# EAGLE board BatteryBoardV2 (EAGLE 8.3.1)
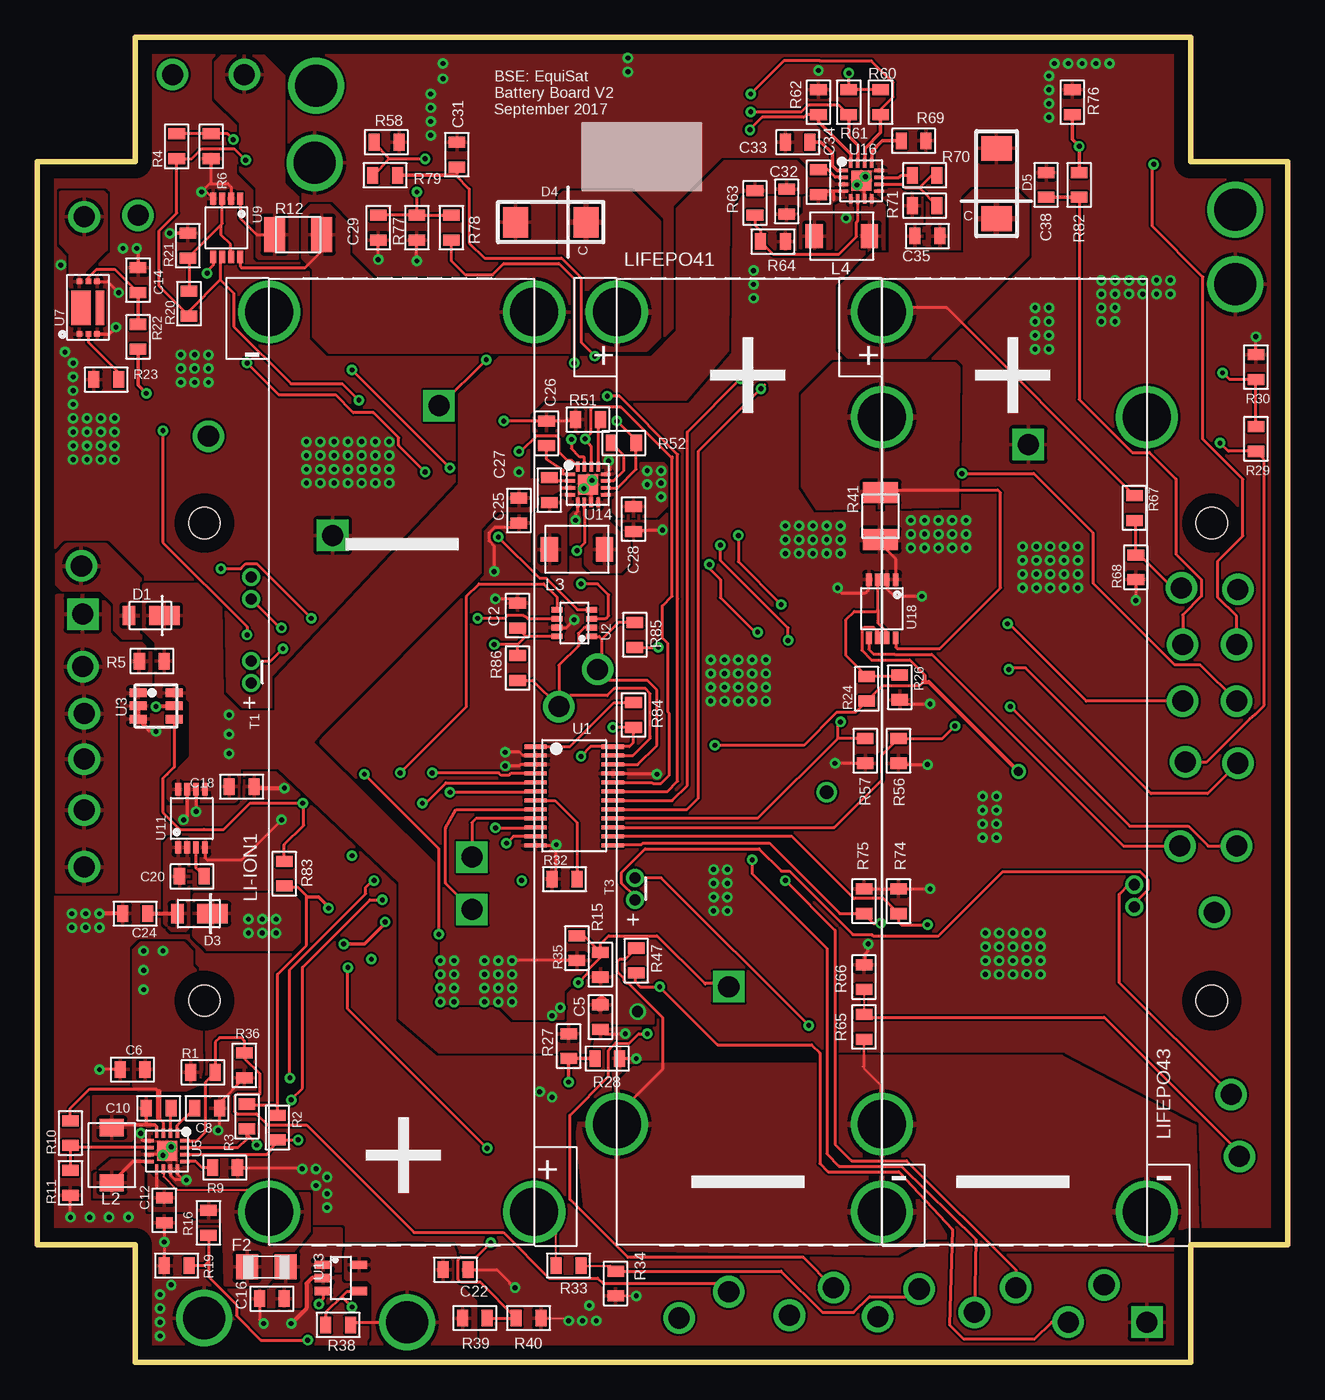
[diagram p6: board, top side]
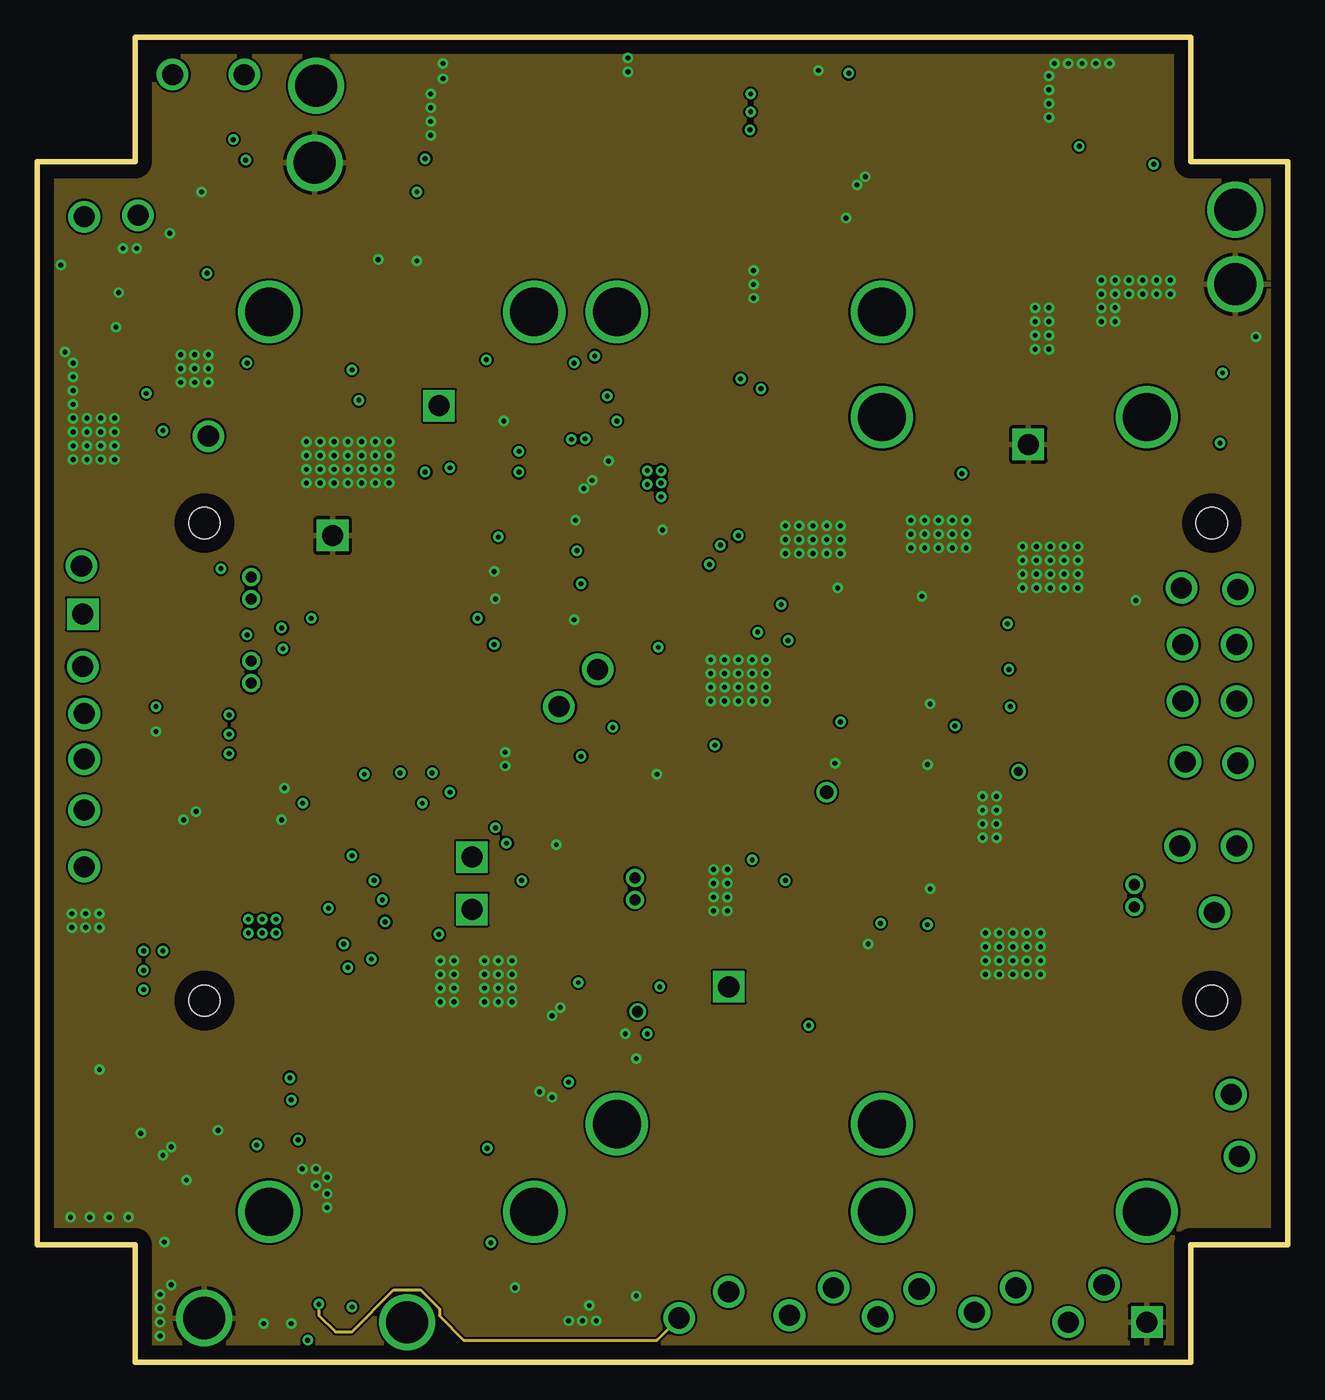
[diagram p7: board, inner layer Route2]
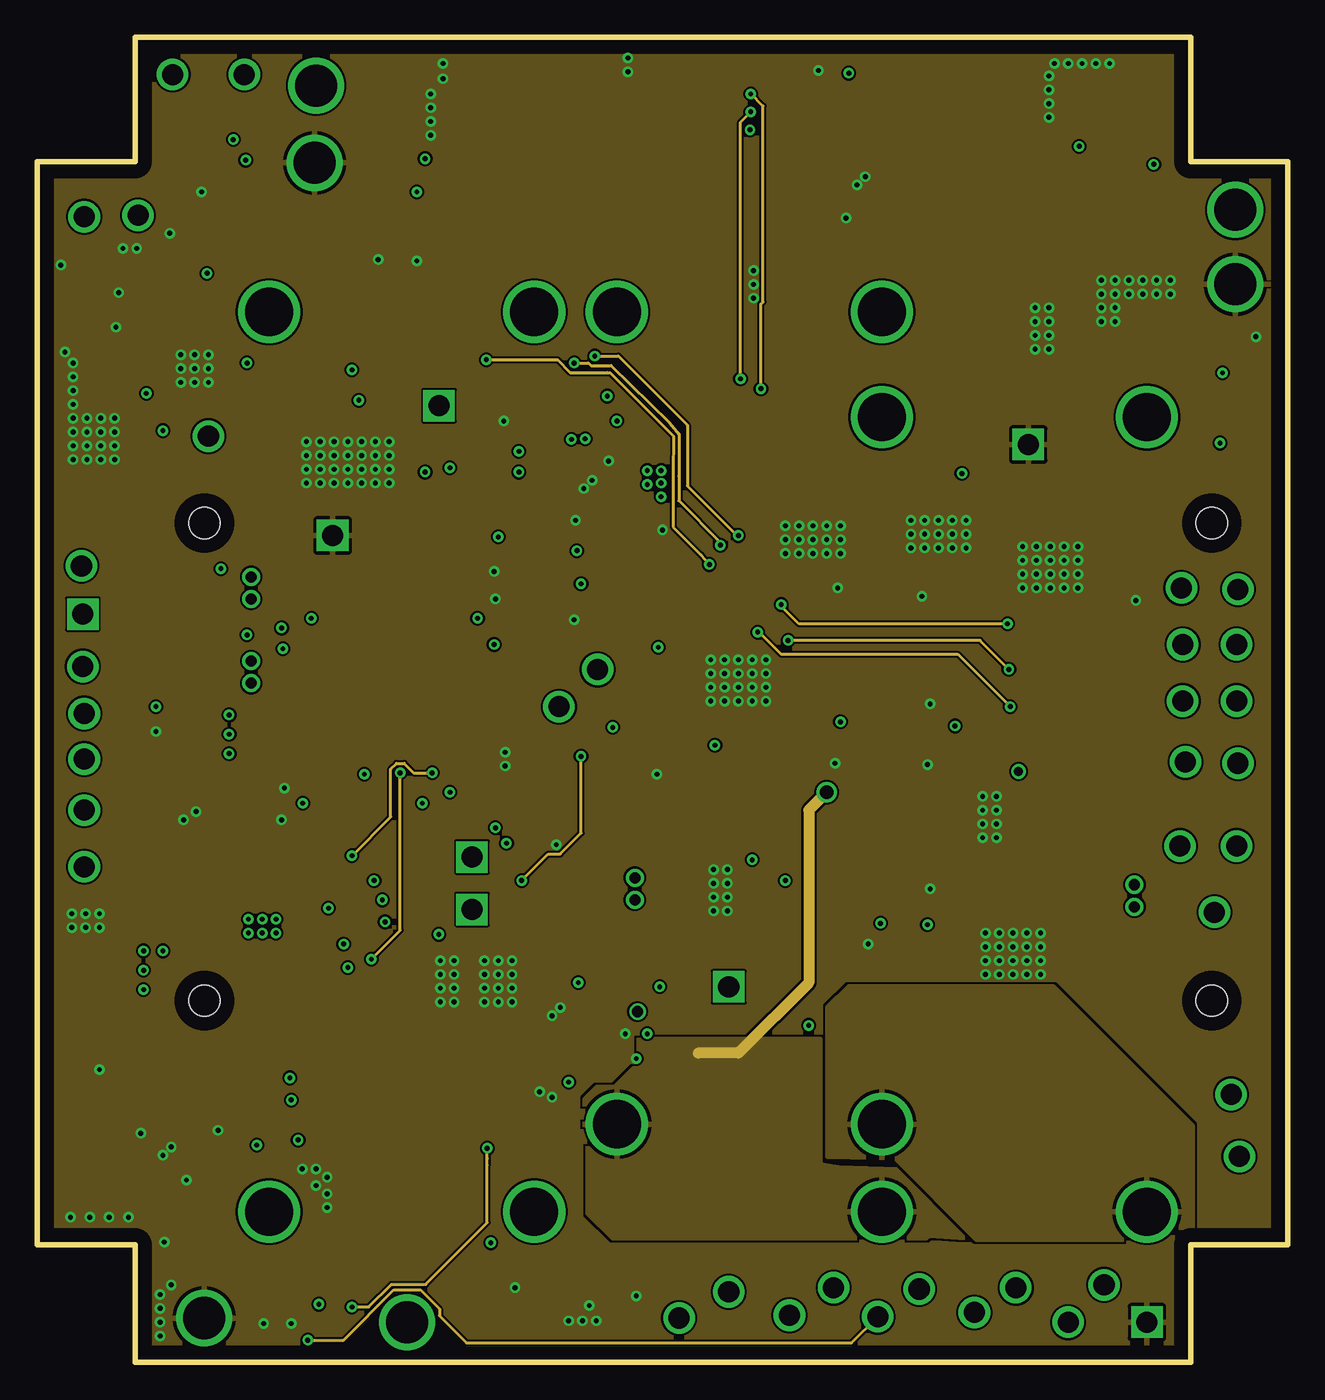
[diagram p8: board, inner layer Route3]
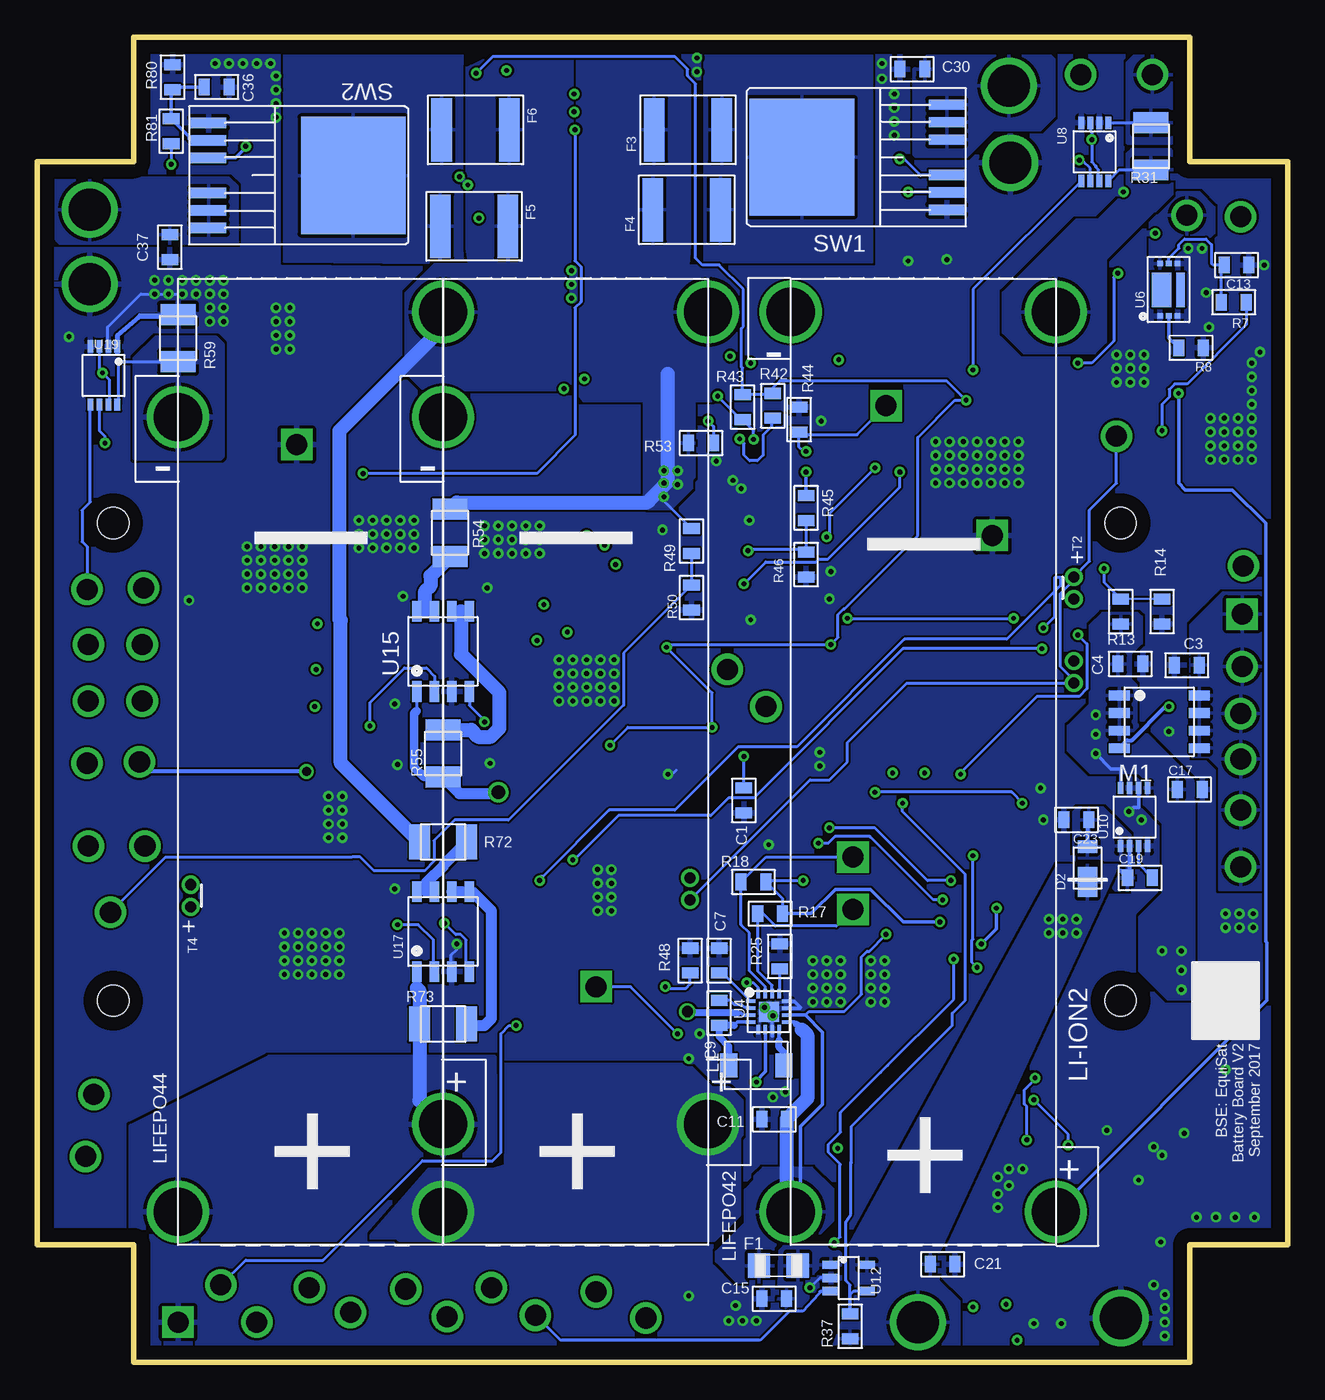
[diagram p9: board, bottom side, seen from below]

Size 90.6 x 96 mm. Coordinates in mm from the lower left corner, seen from the top.
Outline: 0,87 7.1,87 7.1,96 83.6,96 83.6,87 90.6,87 90.6,8.5 83.6,8.5 83.6,0 7.1,0 7.1,8.5 0,8.5 0,87
Copper layers (1*2*3*16): Top 0.035mm / dielectric 0.25mm / Route2 0.035mm / dielectric 0.25mm / Route3 0.035mm / dielectric 0.25mm / Bottom 0.035mm
Design rules "default *": minimum track width 8mil, minimum drill 13mil, track to track 6mil, track to pad 6mil, pad to pad 6mil, via to via 6mil, smd to smd 6mil, copper to edge 40mil, drill to drill 8mil, minimum pad ring 10mil, minimum via ring 8mil, stop-mask expansion 4mil, vias tented up to drill 0mil, thermal gap 10mil
Net classes: 0 default: width 0.254 mm, drill 0.584 mm; 1 Digital: width 0.203 mm, drill 0.381 mm; 2 Analog: width 0.203 mm, drill 0.381 mm; 3 Li-ion: width 2.032 mm, drill 1.905 mm; 4 I2C: width 0.254 mm, drill 0.584 mm, clearance 0.508 mm; 5 SolarPower: width 1.016 mm, drill 1.27 mm; 6 3V3: width 0.381 mm, drill 0.584 mm

## Footprints (pad centres in the part's own frame; a part is rotated, then mirrored left to right if it is on the bottom)
0805 = smd 0.8 x 1.2: 1 -0.9,0; 2 0.9,0
PWRDI-123 = smd 0.9 x 1.4: A 1.45,0 | smd 2.2 x 1.4: C -1.1,0
DO214AA = smd 1.8 x 2.2: A 2.55,0; C -2.55,0
1206 = smd 1.6 x 1.8: 1 -1.4,0; 2 1.4,0
2016 = smd 1.5 x 4.6: P$1 0,0; P$2 4.9,0
1812 = smd 1.25 x 1.75: P$1 -2,0; P$2 2,0
EQUISAT-BATTERY-VA = drill 3.5: MINUS 9.6,-32.6; PLUS -9.6,32.6
EQUISAT-BATTERY-VB = drill 3.5: MINUS 9.6,-24.98; PLUS -9.6,26.25
SO-8 = smd 0.7 x 1.5: P$1 -1.905,-2.9; P$2 -0.635,-2.9; P$3 0.635,-2.9; P$4 1.905,-2.9; P$5 1.905,2.9; P$6 0.635,2.9; P$7 -0.635,2.9; P$8 -1.905,2.9
#2-CLOSE-NPTH = hole 2.27: 0,0
1210 = smd 1.52 x 2.54: P$1 -1.71,0 | smd 1.51 x 2.54: P$2 1.71,0
TO-263-7-8 = smd 0.75 x 2.6: P$1 0,0.7; P$2 1.27,0.7; P$3 2.54,0.7; P$5 5.08,0.7; P$6 6.35,0.7; P$7 7.62,0.7 | smd 8.5 x 7.6: PAD 3.81,11.2
FLATPACK = drill 0.8: + -0.8,0; - 0.8,0
TSSOP-24 = smd 0.3 x 1.6: P$1 0,0; P$2 0.65,0; P$3 1.3,0; P$4 1.95,0; P$5 2.6,0; P$6 3.25,0; P$7 3.9,0; P$8 4.55,0; P$9 5.2,0; P$10 5.85,0; P$11 6.5,0; P$12 7.15,0; P$13 7.15,5.6; P$14 6.5,5.6; P$15 5.85,5.6; P$16 5.2,5.6; P$17 4.55,5.6; P$18 3.9,5.6; P$19 3.25,5.6; P$20 2.6,5.6; P$21 1.95,5.6; P$22 1.3,5.6; P$23 0.65,5.6; P$24 0,5.6
SOT-23-8 = smd 0.4 x 0.8: P$1 -1.016,-1.27; P$2 -0.366,-1.27; P$3 0.284,-1.27; P$4 0.934,-1.27; P$5 0.934,1.23; P$6 0.284,1.23; P$7 -0.366,1.23; P$8 -1.016,1.23
TSOT23-6 = smd 0.62 x 1.22: P$1 0,0; P$2 0.95,0; P$3 1.9,0; P$4 1.9,2.62; P$5 0.95,2.62; P$6 0,2.62
QFN-16-PAD = smd 0.7 x 0.25: P$1 -1.3,0.75; P$2 -1.3,0.25; P$3 -1.3,-0.25; P$4 -1.3,-0.75; P$9 1.3,-0.75; P$10 1.3,-0.25; P$11 1.3,0.25; P$12 1.3,0.75 | smd 0.25 x 0.7: P$5 -0.75,-1.3; P$6 -0.25,-1.3; P$7 0.25,-1.3; P$8 0.75,-1.3; P$13 0.75,1.3; P$14 0.25,1.3; P$15 -0.25,1.3; P$16 -0.75,1.3 | smd 1.45 x 1.45: P$17 0,0
WDFN6 = smd 0.4 x 0.4: P$1 -0.66,-1.89; P$2 -0.01,-1.89; P$3 0.64,-1.89; P$4 0.64,1.91; P$5 -0.01,1.91; P$6 -0.66,1.91 | smd 1.42 x 2.5: PAD1 -0.54,0 | smd 0.62 x 2.5: PAD2 0.85,0
MSOP-8 = smd 0.42 x 0.89: P$1 0,0; P$2 0.65,0; P$3 1.3,0; P$4 1.95,0; P$5 1.95,4.21; P$6 1.3,4.21; P$7 0.65,4.21; P$8 0,4.21
TSOT23-5 = smd 0.6 x 1.2: P$1 -0.95,-1.306; P$2 0,-1.306; P$3 0.95,-1.306; P$4 0.95,1.306; P$5 -0.95,1.306
VIA-120MIL = drill 3.048: P$1 0,0
VIA-60MIL-SQ = drill 1.524 square: P$1 0,0
VIA-60MIL = drill 1.524: P$1 0,0

## Placement (x,y rotation side)
C1  0.1uF  [0805]  39.4,40.7 270 bottom
C2  0.1uF  [0805]  34.8,54.1 90 top
C3  0.1uF  [0805]  7.3,50.5 180 bottom
C4  0.1uF  [0805]  11.4,50.6 0 bottom
C5  10uF  [0805]  40.8,25 270 top
C6  10uF  [0805]  6.9,21.2 180 top
C7  2.2uF  [0805]  41.2,29.1 90 bottom
C8  2.2uF  [0805]  12.3,18.4 0 top
C9  22nF  [0805]  41.2,25.3 270 bottom
C10  22nF  [0805]  8.8,18.4 180 top
C11  22uF  [0805]  37.2,17.6 180 bottom
C12  22uF  [0805]  9.2,11 270 top
C13  0.1uF  [0805]  3.7,79.5 180 bottom
C14  0.1uF  [0805]  7.3,78.4 270 top
C15  1uF  [0805]  37.2,4.6 0 bottom
C16  1uF  [0805]  17,4.6 0 top
C17  1uF  [0805]  7.1,41.5 0 bottom
C18  1uF  [0805]  14.8,41.7 0 top
C19  0.01uF  [0805]  10.7,35.1 0 bottom
C20  0.01uF  [0805]  11.2,35.2 0 top
C21  4.7uF  [0805]  25,7.1 0 bottom
C22  4.7uF  [0805]  30.3,6.7 0 top
C23  10uF  [0805]  15.3,39.3 180 bottom
C24  10uF  [0805]  7.1,32.5 180 top
C25  10uF  [0805]  34.9,61.7 90 top
C26  2.2uF  [0805]  36.9,67.3 270 top
C27  22nF  [0805]  37.1,63.2 90 top
C28  22uF  [0805]  43.2,61.1 270 top
C29  150nF  [0805]  24.7,82.2 90 top
C30  10nF  [0805]  27.2,93.7 180 bottom
C31  10nF  [0805]  30.4,87.5 90 top
C32  10uF  [0805]  54.3,84.1 90 top
C33  2.2uF  [0805]  55.1,88.4 0 top
C34  22nF  [0805]  56.6,85.5 90 top
C35  22uF  [0805]  64.5,81.6 0 top
C36  150nF  [0805]  77.6,92.4 180 bottom
C37  10nF  [0805]  81,80.8 270 bottom
C38  10nF  [0805]  73.1,85.3 90 top
D1  DFLS130L  [PWRDI-123]  8.1,54.1 180 top
D2  DFLS130L  [PWRDI-123]  14.5,35.9 90 bottom
D3  DFLS130L  [PWRDI-123]  11.6,32.5 180 top
D4  SMBJ5343B  [DO214AA]  37.2,82.6 180 top
D5  SMBJ5343B  [DO214AA]  69.5,85.4 90 top
F1  1206L200  [1206]  36.9,7 0 bottom
F2  1206L200  [1206]  16.6,6.9 0 top
F3  2016L500  [2016]  45.9,89.3 0 bottom
F4  2016L500  [2016]  46,83.5 0 bottom
F5  2016L500  [2016]  56.5,82.3 180 bottom
F6  2016L500  [2016]  56.4,89.3 180 bottom
L1  120uH  [1812]  38.5,21.5 0 bottom
L2  120uH  [1812]  5.4,15 270 top
L3  120uH  [1812]  39.1,58.9 180 top
L4  120uH  [1812]  58.3,81.6 180 top
LI-ION1  ~4.1V  [EQUISAT-BATTERY-VA]  26.4,43.5 180 top
LI-ION2  ~4.1V  [EQUISAT-BATTERY-VA]  26.4,43.5 180 bottom
LIFEPO41  ~3.5V  [EQUISAT-BATTERY-VA]  51.6,43.5 0 top
LIFEPO42  ~3.5V  [EQUISAT-BATTERY-VB]  51.6,43.5 180 bottom
LIFEPO43  ~3.5V  [EQUISAT-BATTERY-VA]  70.8,43.5 0 top
LIFEPO44  ~3.5V  [EQUISAT-BATTERY-VB]  70.8,43.5 180 bottom
M1  BSO201SP  [SO-8]  9.3,46.4 270 bottom
MTG1  [#2-CLOSE-NPTH]  12.1,60.8 0 top
MTG2  [#2-CLOSE-NPTH]  12.1,26.2 0 top
MTG3  [#2-CLOSE-NPTH]  85.1,26.2 0 top
MTG4  [#2-CLOSE-NPTH]  85.1,60.8 0 top
R1  40.9K  [0805]  12,21 0 top
R2  470K  [0805]  17.4,17 90 top
R3  470K  [0805]  15.2,17.8 90 top
R4  220K  [0805]  10.1,88.1 90 top
R5  0R  [0805]  8.3,50.8 0 top
R6  100K  [0805]  12.6,88.1 270 top
R7  680R  [0805]  3.9,76.8 0 bottom
R8  1K  [0805]  7,73.5 180 bottom
R9  12.1K  [0805]  13.6,14.1 180 top
R10  330K  [0805]  2.4,16.6 90 top
R11  43K  [0805]  2.4,13 90 top
R12  0.13R@1W  [1210]  18.9,81.7 0 top
R13  40K  [0805]  12.1,54.4 270 bottom
R14  10K  [0805]  9.1,54.4 90 bottom
R15  40.9K  [0805]  40.8,28.8 90 top
R16  150K  [0805]  12.4,10.1 90 top
R17  470K  [0805]  37.5,32.5 0 bottom
R18  470K  [0805]  38.7,34.8 0 bottom
R19  100K  [0805]  10.1,7 0 top
R20  220K  [0805]  11,76.7 90 top
R21  100K  [0805]  10.9,80.9 90 top
R22  680R  [0805]  7.3,74.3 270 top
R23  1K  [0805]  5,71.2 0 top
R24  220K  [0805]  60.1,48.8 90 top
R25  12.1K  [0805]  36.8,29.4 270 bottom
R26  100K  [0805]  62.5,48.9 270 top
R27  330K  [0805]  38.5,22.9 90 top
R28  43K  [0805]  41.3,22 180 top
R29  220K  [0805]  88.3,66.9 90 top
R30  100K  [0805]  88.3,72.1 90 top
R31  0.13R@1W  [1210]  9.9,88.1 270 bottom
R32  100K  [0805]  38.2,35 0 top
R33  150K  [0805]  38.5,7 180 top
R34  100K  [0805]  41.9,5.7 90 top
R35  100K  [0805]  39.1,30 90 top
R36  100K  [0805]  15,21.5 90 top
R37  470K  [0805]  31.7,2.6 270 bottom
R38  470K  [0805]  21.8,2.7 0 top
R39  15K  [0805]  31.7,3.2 180 top
R40  10K  [0805]  35.6,3.2 180 top
R41  0.001R@1W  [1210]  61.1,61.3 90 top
R42  470K  [0805]  37.3,69.3 90 bottom
R43  470K  [0805]  39.5,69.2 90 bottom
R44  100K  [0805]  35.4,68.3 270 bottom
R45  330K  [0805]  34.9,61.9 90 bottom
R46  43K  [0805]  34.9,57.8 90 bottom
R47  95K  [0805]  43.4,29.1 90 top
R48  100K  [0805]  43.3,29.1 270 bottom
R49  287K  [0805]  43.2,59.5 270 bottom
R50  100K  [0805]  43.2,55.4 90 bottom
R51  12.1K  [0805]  39.9,68.3 180 top
R52  887K  [0805]  42.5,66.6 0 top
R53  1.74M  [0805]  42.5,66.6 180 bottom
R54  34.8R@1W  [1210]  60.7,60.1 90 bottom
R55  34.8R@1W  [1210]  61.2,44.1 90 bottom
R56  100K  [0805]  62.4,44.3 90 top
R57  100K  [0805]  60,44.3 90 top
R58  1K  [0805]  25.3,88.4 180 top
R59  0.001R@1W  [1210]  80.4,74.2 270 bottom
R60  470K  [0805]  61.1,91.3 90 top
R61  470K  [0805]  58.8,91.3 90 top
R62  100K  [0805]  56.6,91.3 270 top
R63  330K  [0805]  52,84 90 top
R64  43K  [0805]  53.3,81.2 180 top
R65  95K  [0805]  59.9,24.3 270 top
R66  100K  [0805]  59.9,27.9 270 top
R67  287K  [0805]  79.5,61.9 270 top
R68  100K  [0805]  79.6,57.6 90 top
R69  12.1K  [0805]  63.5,88.5 0 top
R70  887K  [0805]  64.3,86 0 top
R71  1.74M  [0805]  64.3,83.8 180 top
R72  34.8R@1W  [1210]  61.2,37.7 180 bottom
R73  34.8R@1W  [1210]  61.2,24.5 0 bottom
R74  100K  [0805]  62.4,33.4 270 top
R75  100K  [0805]  59.9,33.4 270 top
R76  1K  [0805]  75,91.3 270 top
R77  100K  [0805]  27.5,82.2 90 top
R78  4.7K  [0805]  30,82.2 90 top
R79  4.7K  [0805]  25.2,86 180 top
R80  100K  [0805]  80.8,93.1 270 bottom
R81  4.7K  [0805]  80.9,89.2 90 bottom
R82  4.7K  [0805]  75.5,85.3 90 top
R83  470K  [0805]  17.9,35.4 270 top
R84  1M  [0805]  43.2,46.9 270 top
R85  2.4K  [0805]  43.3,52.7 270 top
R86  2.4K  [0805]  34.8,50.3 90 top
SW1  BTS50015-1TAD  [TO-263-7-8]  24,83.5 90 bottom
SW2  BTS50015-1TAD  [TO-263-7-8]  78.9,89.8 270 bottom
T1  AD590FLATPACK  [FLATPACK]  15.5,50 90 top
T2  AD590FLATPACK  [FLATPACK]  15.5,56.1 270 bottom
T3  AD590FLATPACK  [FLATPACK]  43.3,34.3 90 top
T4  AD590FLATPACK  [FLATPACK]  79.5,33.8 90 bottom
U1  TCA9535PWR  [TSSOP-24]  36.1,44.6 270 top
U2  AD7991-0  [SOT-23-8]  38.9,53.6 90 top
U3  LTC4412MPS6  [TSOT23-6]  7.3,48.5 270 top
U4  LTC4121-4.2  [QFN-16-PAD]  37.6,25.4 0 bottom
U5  LTC4121-4.2  [QFN-16-PAD]  9.4,15.3 270 top
U6  LC05111C13MTTTG  [WDFN6]  8.6,77.7 0 bottom
U7  LC05111C13MTTTG  [WDFN6]  3.7,76.4 0 top
U8  AD8418  [MSOP-8]  13,89.8 180 bottom
U9  AD8418  [MSOP-8]  14.7,84.3 180 top
U10  LT1962-3  [MSOP-8]  12.1,37.4 0 bottom
U11  LT1962-3  [MSOP-8]  10.2,37.3 0 top
U12  LTC4411  [TSOT23-5]  31.8,6.1 270 bottom
U13  LTC4411  [TSOT23-5]  22,6.1 270 top
U14  LTC4121  [QFN-16-PAD]  39.9,63.6 0 top
U15  VNS3NV04DP-E  [SO-8]  61.2,51.5 0 bottom
U16  LTC4121  [QFN-16-PAD]  59.7,85.6 0 top
U17  VNS3NV04DP-E  [SO-8]  61.2,31.2 0 bottom
U18  AD8418  [MSOP-8]  62.2,56.7 180 top
U19  AD8418  [MSOP-8]  84.8,73.6 180 bottom
V1  GND  [VIA-120MIL]  12.1,3.2 90 top
V2  GND  [VIA-120MIL]  20.1,86.9 180 top
V3  GND  [VIA-60MIL-SQ]  21.4,59.9 0 top
V4  GND  [VIA-120MIL]  86.8,78.1 90 top
V5  SCL  [VIA-60MIL]  40.6,50.2 0 top
V6  SDA  [VIA-60MIL]  37.8,47.5 180 top
V7  5V  [VIA-60MIL]  12.4,67.1 0 top
V8  L1_TEMP  [VIA-60MIL]  67.9,3.6 0 top
V9  L2_TEMP  [VIA-60MIL]  70.9,5.4 0 top
V10  LF1_TEMP  [VIA-60MIL]  77.3,5.6 270 top
V11  LF3_TEMP  [VIA-60MIL]  86.5,19.4 90 top
V12  3V3  [VIA-60MIL]  83.2,43.5 0 top
V13  X_P  [VIA-60MIL]  3.3,50.4 180 top
V14  X_P  [VIA-60MIL-SQ]  3.3,54.2 90 top
V15  X_N  [VIA-60MIL]  3.4,47 180 top
V16  Z_P  [VIA-60MIL]  3.4,43.7 180 top
V17  Z_N  [VIA-60MIL]  3.4,40 180 top
V18  Y_N  [VIA-60MIL]  3.4,35.9 180 top
V19  UMB_CHG  [VIA-60MIL]  3.2,57.7 90 top
V20  L1_CHG  [VIA-60MIL]  57.7,5.4 270 top
V21  L1_REF  [VIA-60MIL]  63.9,5.3 90 top
V22  L1_GND+  [VIA-60MIL]  9.8,93.3 180 top
V23  L1_GND-  [VIA-60MIL]  7.3,83.1 270 top
V24  L2_GND+  [VIA-60MIL]  15,93.3 180 top
V25  L2_GND-  [VIA-60MIL]  3.4,83 90 top
V26  L1_FAULTN  [VIA-60MIL-SQ]  31.5,36.6 90 top
V27  L1_CHGN  [VIA-60MIL-SQ]  31.5,32.8 90 top
V28  GND  [VIA-60MIL-SQ]  80.4,2.9 180 top
V29  L1_DISG  [VIA-60MIL]  54.5,3.4 180 top
V30  L2_DISG  [VIA-60MIL]  46.5,3.2 180 top
V31  L2_REF  [VIA-60MIL]  60.9,3.3 0 top
V32  LFB1_CHG  [VIA-60MIL-SQ]  29.1,69.3 0 top
V33  L2_CHG  [VIA-60MIL]  50.1,5.1 0 top
V34  L_OUT  [VIA-120MIL]  26.8,2.9 0 top
V35  LFB1_CHG  [VIA-60MIL]  86.9,37.4 90 top
V36  GND  [VIA-60MIL-SQ]  71.8,66.5 180 top
V40  LFB1SNS  [VIA-60MIL]  82.8,37.4 270 top
V41  LF1_REF  [VIA-60MIL]  85.3,32.6 90 top
V42  LF2_REF  [VIA-60MIL]  74.7,2.9 0 top
V43  LFB1_OUTEN  [VIA-60MIL]  87,43.4 270 top
V44  LFB2SNS  [VIA-60MIL]  87,56 270 top
V45  LF_B1  [VIA-120MIL]  20.2,92.5 0 top
V46  LFB1_OSNS  [VIA-60MIL]  83,47.9 180 top
V47  LFB2_CHG  [VIA-60MIL]  86.9,47.9 0 top
V48  L1_CHG  [VIA-60MIL-SQ]  50.1,27.2 0 top
V49  LF3_REF  [VIA-60MIL]  82.9,56.1 270 top
V50  LF4_REF  [VIA-60MIL]  87.1,14.9 90 top
V51  LFB2_OUTEN  [VIA-60MIL]  86.9,52 90 top
V53  LF_B2  [VIA-120MIL]  86.8,83.5 0 top
V99  LFB2_OSNS  [VIA-60MIL]  83,52 180 top

## Tracks (layer width: path | path; a pad name or v marks a point on that pad's centre or on a via)
5V
  Top 0.203: T3.+ 43.3,33.74 42.34,34.7 42.34,35.5 44.04,37.2 52.3,37.2 53.92,35.58 54.48,35.58 59.08,30.98 60.48,30.98 60.57,30.9 65.3,30.9 69.96,35.56 79.9,35.56 80.46,35 80.46,34.2 79.5,33.24 T4.+
  Bottom 0.203: T3.+ 34.6,42.2 33.2,42.2 31.9,43.5 31.9,44.9 27.6,49.2 T1.+ 15.5,49.44 16.46,50.4 16.46,55.7 15.5,56.66 T2.+ 14.35,58.05 14.35,61.73 12.4,63.69 V7.P$1
!BATT_INT!
  Top 0.203: U1.P$1 38.6,44.6 41.8,47.8 R84.1
+3V3  (via drill 0.35, 0.65)
  Top 0.152: 37.65,52.6 U2.P$8 | C2.1 35.2,53.2
  Top 0.203: v85.7,66.6 86.3,66 R29.1 88.9,65.4 88.9,47.6 88.25,46.95 87.85,46.6 84.75,43.5 V12.P$1 | U2.P$8 35.9,52.58 | 35.9,52.58 35.42,52.58 C2.1 | 35.9,52.58 35.38,52.58 34.8,52 | R86.2 34.8,52 | v39.4,43.9 40.1,44.6 U1.P$24 42.9,44.6 43.2,44.9 R84.2 v41.7,46 | v15.1,87.1 14.29,87.91 11.87,87.91 11.17,87.2 R4.1 10.1,83.27 8.82,81.98 8.82,77.98 R20.1 11,76.17 13.27,78.43 | U9.P$6 13.27,79.95 13.27,78.43 | 13.27,78.43 14.24,77.46 14.24,75.04 18.38,70.9 22.1,70.9 v23.3,69.7 | R2.2 17.4,18.5 | 17.4,18.5 17.3,18.6 15.3,18.6 R3.2 | 17.4,18.5 17.4,28.1 19.5,30.2 19.5,33.7 19.5,33.8 18.9,34.4 18,34.4 R83.2 | 34.8,52 v33.1,52 | R85.2 v45,51.8 | v41.7,46 41.6,46 v41.7,46 | U18.P$6 60.9,53 60.83,53 60.59,53.24 59.91,53.24 59.73,53.06 59.73,51.59 60.44,50.89 63.21,50.89 64.3,49.8 64.3,49.4 64.2,49.3 63.9,49 61.2,49 R24.1 59.28,47.08 57.92,47.08 55.53,44.7 v49.1,44.7 | R60.2 R61.2 v58.8,93.4
  Top 0.254: 19.5,33.7 20.4,33.7 21,33.1 21,33 v21.1,32.9 | v22.2,30.3 23.7,30.3 25.2,31.8 v25.2,31.9
  Top 0.305: 64.2,49.3 64.6,49.3 v71.1,42.8 | v71.1,42.8 71.2,42.7 v71.1,42.8
  Route3 0.203: v35.1,34.9 37.02,36.82 37.88,36.82 39.4,38.33 v39.4,43.9
  Bottom 0.203: U19.P$6 86.1,67.5 85.7,67.1 v85.7,66.6 | C1.1 v39.4,43.9 | U8.P$6 14.3,86.5 14.8,87 15.1,87 v15.1,87.1 | R17.2 36.6,33.6 R18.2 37.7,34.9 v35.1,34.9 | v49.1,44.7 47.8,46 v41.7,46 41.7,48.5 v45,51.8 44.8,52 v33.1,52 32.58,52.52 32.58,54.18 32.18,54.58 32.12,54.58 26.8,59.9 26.8,67 24.1,69.7 v23.3,69.7 24.7,71.1 36.8,71.1 37.3,70.6 R42.2 37.4,70.1 R43.2 39.5,72.03 39.58,72.12 39.58,74.89 39.44,75.04 39.44,77.74 41.2,79.5 42.4,79.5 42.9,80 42.9,92.63 43.48,93.22 43.48,93.68 44.4,94.6 57.6,94.6 v58.8,93.4
  Bottom 0.254: v21.1,32.9 21.1,31.4 v22.2,30.3 | v25.2,31.9 27.85,31.9 30.22,34.27 32.78,34.27 34.55,32.5 R17.2
  Bottom 0.305: v71.1,42.8 82.5,42.8 V12.P$1
GND  (via drill 0.35)
  Top 0.152: R40.1 38.3,3.2 v38.5,3 | R34.1 v43.4,4.8
  Top 0.203: U5.P$7 9.15,15.05 U5.P$17 v9.1,15 | U5.P$11 9.65,13.55 10,13.2 10.59,13.2 | 10.59,13.2 v10.8,13.2 | U5.P$12 10.15,13.64 10.59,13.2 | C6.2 v4.5,21.2 | v2.4,10.5 R11.1 | R19.1 v9.2,8.7 C12.2 | R68.1 v79.6,55.2 | v24.7,79.9 C29.1 | v27.5,79.8 R77.1 | R28.1 42.8,22 v43.4,22 | C22.2 33.3,6.7 34.24,5.76 34.24,5.68 v34.62,5.4 | U5.P$5 7.65,16.05 7.6,16.1 7.6,16.4 7.5,16.5 v7.5,16.59 | R9.1 19.1,14.1 v19.2,14 | v13.1,16.8 13.2,16.9 C8.2 13.2,18.8 R36.1 | U11.P$4 12.15,36.55 12.3,36.4 14.8,36.4 v17.7,39.3 | U1.P$21 44.85,42.65 44.9,42.7 v44.9,42.6 | U1.P$12 37.65,37.46 v37.61,37.5 v37.6,37.5 37.6,35.3 R32.1 | U9.P$4 12.25,84.8 v11.9,84.8 | v11.9,84.8 12.5,85.4 13.8,85.4 14.05,85.15 U9.P$2 | v11.9,84.8 12.6,85.5 R6.2 | U1.P$2 36.08,43.97 35.19,43.97 34.96,44.2 v33.9,44.2 | U1.P$3 35,43.3 34.9,43.2 v33.9,43.2 | R66.1 60,28.9 60,29.6 60.2,29.8 v60.2,30.3 | R57.1 v57.8,43.4 | R56.1 62.5,43.3 v64.5,43.3 | R26.2 62.8,47.7 v64.7,47.7 | U7.P$4 5.09,78.31 v5.9,77.5 | U16.P$7 59.95,85.13 59.78,85.3 v59.4,85.3 | C16.1 16.1,3.1 v16.4,2.8 | C5.2 41.1,23.8 v42.6,23.8 | R35.1 v34.4,29.1 | U2.P$7 37.7,53.2 38.3,53.2 v38.9,53.8 | C2.2 34.5,55.3 v33.2,55.3 | 62.44,34.3 R74.1 | 62.44,34.3 v64.7,34.3 | R75.1 62.44,34.3 | U14.P$12 41.5,64.65 41.5,65.2 v41.4,65.3 | U18.P$2 61.6,56.65 61.6,56 62.1,55.5 v64.1,55.5 | 60.3,56.75 U18.P$4 60.2,56.65 60.2,55.9 60,55.7 58.3,55.7 58,56 v58,56.1 | U18.P$1 62.2,58.2 61.1,59.3 R41.P$1 | 38.9,68.2 R51.2 38.9,68.2 | v33.8,68.2 C26.1 38.9,68.2 | v33.8,68.2 33.7,68.2 v33.8,68.2 | U14.P$7 40.15,62.99 39.84,63.3 v39.6,63.3 U14.P$17 | U14.P$5 39.14,61.62 39,61.48 v39,61 | C28.2 43.3,60.3 v45.3,60.3 | v45.3,60.3 45.4,60.3 v45.3,60.3
  Top 0.203: v33.1,57.3 33.1,59.13 32.72,59.52 32.72,60.08 33.12,60.48 34.58,60.48 C25.1 | R30.2 v88.3,74.3
  Top 0.254: v11.5,39.9 U11.P$6 | U11.P$7 10.85,39.55 v10.6,39.3 | R21.2 v9.6,81.8 | v5.7,75 5.21,74.51 U7.P$3 | v7.2,80.7 7.3,80.5 C14.1
  Top 0.305: U3.P$2 U3.P$3 8.1,45.8 8.6,45.8 v8.6,45.7 | C24.2 v4.5,32.5 | C18.2 15.8,41.6 v17.9,41.6 | U13.P$2 19.9,6.1 19.5,5.7 19.5,3.9 v18.4,2.8
  Bottom 0.203: 34.3,5.7 33.9,6.1 | 33.9,6.1 34.3,5.7 | v44.9,42.6 44.6,42.6 44.3,42.9 | U17.P$3 60.6,28.34 60.6,29.5 60.2,29.9 v60.2,30.3 | U12.P$2 33.9,6.1 | v34.62,5.4 34.4,5.62 34.3,5.7 | U19.P$1 84.8,74.3 83.19,75.91 R59.P$1 | U19.P$2 85.5,73.65 85.5,75 83.1,77.4 v80.1,77.4
  Bottom 0.254: U10.P$6 10.8,40.2 11.2,40.2 v11.5,39.9 | 37.35,23.65 U4.P$7 37.35,25.05 v37.3,25.1 | U4.P$11 35.35,25.65 35.3,25.7 35.75,26.15 U4.P$12
  other vias: 9.7,15.6 63.3,59 63.3,60 63.3,61 64.3,61 64.3,60 66.3,61 65.3,61 65.3,60 67.3,61 66.3,60 78.1,76.4 78.1,75.4 78.1,77.4 79.1,77.4 81.1,77.4 82.1,77.4 73.7,94.1 74.7,94.1 56.6,93.6 51.9,79.1 73.3,90.2 73.3,91.2 28.5,91.9 6.2,80.7 1.7,79.5 2.6,69.4 3.5,32.5 2.5,32.5 2.5,31.5 3.5,31.5 4.5,31.5 37.9,25.7 34.4,27.1 34.4,28.1 33.4,28.1 33.4,26.1 32.4,26.1 32.4,28.1 30.2,29.1 33.4,29.1 34.4,26.1 33.4,27.1 32.4,27.1 3.8,10.5 5.2,10.5 6.6,10.5 2.6,68.4 3.6,68.4 4.6,68.4 4.6,67.4 3.6,67.4 2.6,67.4 2.6,66.4 3.6,66.4 4.6,66.4 2.6,65.4 3.6,65.4 4.6,65.4 10.4,72 11.4,72 12.4,72 12.4,71 11.4,71 10.4,71 10.4,73 11.4,73 12.4,73 5.6,68.4 5.6,67.4 5.6,66.4 5.6,65.4 29.2,29.1 32.4,29.1 30.2,28.1 30.2,27.1 30.2,26.1 29.2,26.1 29.2,27.1 29.2,28.1 67.3,60 64.3,59 65.3,59 66.3,59 67.3,59 82.1,78.4 81.1,78.4 80.1,78.4 79.1,78.4 78.1,78.4 77.1,78.4 77.1,77.4 77.1,76.4 77.1,75.4 54.2,58.6 54.2,59.6 54.2,60.6 55.2,60.6 55.2,59.6 57.2,60.6 56.2,60.6 56.2,59.6 58.2,60.6 57.2,59.6 58.2,59.6 55.2,58.6 56.2,58.6 57.2,58.6 58.2,58.6 40.2,63.9 40.5,3 40,4.1 39.5,3 20.2,14 21,13.4 20.2,12.8 21,12.2 21,11.2 72.7,29.1 72.7,30.1 71.7,30.1 71.7,28.1 70.7,28.1 70.7,30.1 69.7,31.1 71.7,31.1 72.7,31.1 72.7,28.1 71.7,29.1 70.7,29.1 68.7,31.1 70.7,31.1 69.7,30.1 69.7,29.1 69.7,28.1 68.7,28.1 68.7,29.1 68.7,30.1 75.4,57.1 75.4,58.1 74.4,58.1 74.4,56.1 73.4,56.1 73.4,58.1 72.4,59.1 74.4,59.1 75.4,59.1 75.4,56.1 74.4,57.1 73.4,57.1 71.4,59.1 73.4,59.1 72.4,58.1 72.4,57.1 72.4,56.1 71.4,56.1 71.4,57.1 71.4,58.1 52.8,48.9 52.8,49.9 51.8,49.9 51.8,47.9 50.8,47.9 50.8,49.9 49.8,50.9 51.8,50.9 52.8,50.9 52.8,47.9 51.8,48.9 50.8,48.9 48.8,50.9 50.8,50.9 49.8,49.9 49.8,48.9 49.8,47.9 48.8,47.9 48.8,48.9 48.8,49.9 25.5,64.7 25.5,65.7 24.5,65.7 24.5,63.7 23.5,63.7 23.5,65.7 22.5,66.7 24.5,66.7 25.5,66.7 25.5,63.7 24.5,64.7 23.5,64.7 21.5,66.7 23.5,66.7 22.5,65.7 22.5,64.7 22.5,63.7 21.5,63.7 21.5,64.7 21.5,65.7 28.5,90.9 28.5,89.9 28.5,88.9 29.4,93 29.4,94.1 75.7,94.1 76.7,94.1 77.7,94.1 73.3,93.2 73.3,92.2 2.6,71.4 2.6,70.4 2.6,72.4 2,73.2 42.8,94.5 42.8,93.5 60,85.9 58.6,82.9 51.9,78.1 51.9,77.1 8.9,4.9 8.9,3.9 8.9,2.9 8.9,1.9 9.7,5.6 36.4,19.6 37.3,19.2 20.5,66.7 19.5,66.7 20.5,65.7 20.5,64.7 20.5,63.7 19.5,63.7 19.5,64.7 19.5,65.7 73.3,76.4 72.3,76.4 73.3,75.4 73.3,74.4 73.3,73.4 72.3,73.4 72.3,74.4 72.3,75.4 69.5,41 68.5,41 69.5,40 69.5,39 69.5,38 68.5,38 68.5,39 68.5,40 50,35.7 49,35.7 50,34.7 50,33.7 50,32.7 49,32.7 49,33.7 49,34.7
  pour Route2: -7.3,121.4 106.7,121.4 108.1,-18 -5.9,-18
  pour Bottom (rank 6): -1.8,126.4 106.8,126.4 114.2,94.5 114.2,-17.2 -3.9,-17.4 -3.9,98.2 -3.5,99 -2.7,99
  pour Route3 (rank 4): -10.1,135.7 104.4,116.1 103.4,-16.1 -10.6,-16.1
  pour Top: 55.8,61.4 67.4,61.6 68.5,59.6 68.5,58.6 68.3,58 53.6,57.7 53.6,60 54.2,61.3
  pour Top (rank 4): 18.1,89.5 18.1,85.6 19.3,84.4 21.1,84.4 22.8,82.7 23,82.5 23,80.5 24.6,78.9 32.9,78.9 34.1,80.1 36,80.1 36.7,80.8 36.7,93.6 35.6,94.7 26.3,94.7 21.1,89.5
  pour Top (rank 4): 67.5,85.3 73.9,85.3 74.3,85.7 74.3,88.7 80.1,94.5 63.5,94.5 63.5,87.7 64,87.3 66,87.3 67.5,85.8
  pour Top: 1.4,74.8 1.5,74.9 3.4,74.9 3.7,74.8 3.7,70.5 4.3,69.7 5.4,69.7 6.5,68.6 6.5,64.5 5.8,63.8 1.6,63.8 1.4,64
  pour Top (rank 6): 34.8,95.1 36.4,93.5 36.4,81.2 42.9,74.7 64,74.7 67.5,76.8 67.5,97.4 63.8,95.1
  pour Top (rank 6): -10.4,105.2 -10.4,-6.1 102.2,-6.1 102.2,105.2
L1_CHG  (via drill 0.35)
  Top 0.203: v39.2,27.5 39.9,28.2 39.9,28.43 40.8,29.33 R15.2 | R15.2 40.8,30.3 41.4,30.9 44.9,30.9 48.37,27.43 | 48.37,27.43 48.4,27.4 | V48.P$1 49.87,27.43 48.37,27.43 | R15.2 39.6,30.9 R35.2 | V20.P$1 55.5,7.6 42.8,7.6 38.6,11.8 38.6,17.9 41.4,20.7 41.4,22.6 41.5,22.7 41.5,22.73 41.89,23.12 42.88,23.12 43.57,23.8 v44.2,23.8 | v44.2,23.8 44.4,23.8 v44.2,23.8
  Bottom 0.203: U4.P$16 38.35,27.14 38.71,27.5 v39.2,27.5 | v44.2,23.8 47.6,27.2 V48.P$1
L1_CHGN
  Top 0.203: V27.P$1 29.6,34.7 29.6,38.7 30.35,40.05 U1.P$8
  Bottom 0.203: U4.P$14 37.36,27.32 38.4,28.36 R17.1 38.03,32.5 37.13,31.59 32.7,31.59 V27.P$1
L1_DISG
  Bottom 0.203: 33.79,5.15 33.85,5.15 33.89,5.11 | 33.79,5.15 U12.P$3 33.79,5.15 | 33.79,5.15 33.99,4.93 35.13,3.69 36.1,3.69 38.2,1.6 52.7,1.6 V29.P$1
L1_FAULTN
  Top 0.203: V26.P$1 31.5,39.1 31.8,39.4 U1.P$9
  Bottom 0.203: U4.P$15 37.85,27.21 39,28.36 39,31.1 39.6,31.7 R18.1 37.8,36.6 V26.P$1
L1_PROG
  Bottom 0.203: U4.P$13 36.8,26.75 R25.2
L1_REF
  Top 0.152: R33.1 41.5,7 R34.2
  Top 0.203: R34.2 53.9,6.6 56.9,3.6 59.15,3.6 60.3,4.75 63.35,4.75 V21.P$1
L1_SNS  (via drill 0.35)
  Top 0.203: v29.9,64.8 29.8,64.8 29.8,64.9 v22.8,71.9 | v33.4,59.8 36.39,56.81 36.87,56.81 39.14,54.53 U2.P$4
  Bottom 0.203: U8.P$5 22.8,77.74 v22.8,71.9 | v29.9,64.8 33.2,61.5 33.2,59.8 v33.4,59.8
L1_SNS+
  Bottom 0.203: U8.P$8 12.2,86.39 R31.P$2
  pour Bottom (rank 2): 15.6,73.1 19.1,73.1 20.6,74.6 20.6,77.5 15.3,82.8 13.7,82.8 11.6,84.9 11.6,87.6 11.3,87.9 8.5,87.9 8.4,87.8 8.4,84.6 9.6,83.4 9.7,83.4 13.2,79.9 13.2,73.9 14,73.1
L1_SNS-
  Bottom 0.203: U8.P$1 R31.P$1
  pour Bottom: 8.4,88.3 11.6,88.3 11.6,94.2 11.1,94.7 8.3,94.7 8.2,94.8 8.2,88.4 8.3,88.4
L1_ST  (via drill 0.35)
  Top 0.203: U1.P$5 36.08,41.98 29.62,41.98 28.13,40.5 v27.9,40.5
  Bottom 0.203: U12.P$4 31.45,5.15 31.7,4.9 R37.1 31.7,5.6 32,5.9 32,10.18 31.65,10.73 31.65,14.49 31.62,14.42 31.62,17.08 24.3,24.4 24.3,25.28 23.35,26.23 23.35,35.35 27.9,39.9 v27.9,40.5
L1_TEMP  (via drill 0.35)
  Top 0.203: T1.- 16.9,50.8 v17.8,51.7 | v51.8,36.4 51.8,35.4 57.2,30 57.2,15.1 58.1,14.2 62.6,14.2 68,8.9 V8.P$1
  Bottom 0.203: v17.8,51.7 27.87,51.7 38.67,40.9 40.51,40.9 41.8,39.6 48.5,39.6 51.6,36.5 51.7,36.5 v51.8,36.4
L2_CHG
  Top 0.203: U5.P$16 11.55,16.05 12.2,16.7 12.2,20.3 R1.2 12.9,23.2 13.2,23.5 14.8,23.5 15,23.3 R36.2 15,22.03 16.11,20.93 16.11,19.41 14.47,19.41 14.29,19.23 14.29,18.17 14.47,18 15.87,18 16.67,17.2 19.5,17.2 27.3,9.4 33.77,9.4 37.07,6.09 40.61,6.09 41,5.7 49.5,5.7 V33.P$1
L2_CHGN  (via drill 0.35)
  Top 0.203: U5.P$14 16.65,15.05 R2.1 v18.9,16.1 | v18.3,20.6 18.3,28.43 23.81,33.93 23.81,34.41 24.3,34.9 v24.4,34.9 | v33.2,38.72 36.07,38.72 U1.P$10
  Bottom 0.203: v18.9,16.1 18.9,18.53 19.08,18.72 19.08,19.72 18.3,20.5 v18.3,20.6 | v24.4,34.9 26.1,34.9 29.9,38.7 33,38.7 v33.2,38.72
L2_DISG  (via drill 0.35)
  Top 0.203: U13.P$3 20.69,4.59 v20.4,4.2
  Route2 0.203: v20.4,4.2 20.4,3.4 21.6,2.2 22.8,2.2 25.83,5.24 27.77,5.24 29.14,3.87 29.14,3.36 30.9,1.6 44.9,1.6 V30.P$1
L2_FAULTN  (via drill 0.35)
  Top 0.203: U5.P$15 14.55,15.55 15.2,16.2 R3.1 | R3.1 15.4,16.9 | R3.1 15.2,16.5 15.9,15.8 v15.9,15.73 | v18.4,19 18.4,19.03 19.21,19.85 19.21,28.61 24.1,33.5 v25,33.5 | U1.P$11 34.5,38.1 v34,37.6
  Bottom 0.203: v15.9,15.73 15.9,16.5 v18.4,19 | v25,33.5 25.68,33.5 30.23,38.05 30.25,38.05 30.3,38.1 32.8,38.1 33.3,37.6 v34,37.6
L2_PROG
  Top 0.203: R9.2 11.94,14.1 11.49,14.55 U5.P$13
L2_REF  (via drill 0.35)
  Top 0.203: R16.1 12.4,7.3 | 12.4,7.3 12.1,7 R19.2 11,6.8 | 12.4,7.3 12.4,6.21 14.44,4.17 14.44,3.36 16.2,1.6 v19.6,1.6
  Route3 0.203: v19.6,1.6 22.2,1.6 25.83,5.24 27.77,5.24 29.14,3.87 29.14,3.36 31.1,1.4 59,1.4 V31.P$1
L2_SNS  (via drill 0.35)
  Top 0.203: U9.P$5 12.74,79.49 12.3,79.05 v12.3,78.9 | v15.2,72.4 17.5,70.1 21.6,70.1 22.9,68.8 24.37,68.8 26.18,66.98 26.18,66.42 v28.1,64.5 | U2.P$3 40.25,53.9 41.2,53.9 41.4,54.1 41.4,55.6 40.6,56.4 v39.4,56.4 | v39.4,56.4 39.3,56.4 v39.4,56.4
  Bottom 0.203: v12.3,78.9 12.6,78.6 12.6,74 14.2,72.4 v15.2,72.4 | v39.4,56.4 37.8,57.99 34.17,57.99 33.97,58.2 33.3,58.2 28.1,63.4 v28.1,64.5
L2_SNS+
  Top 0.203: U9.P$8 14.7,79.4 14.8,79.3 19.4,79.3 20.61,80.51 R12.P$2
  pour Top: 32.9,78.4 24.4,78.4 22.6,80.2 22.6,82.4 21.2,83.8 19.8,83.8 19.2,83.2 19.2,80 20,79.2 20,74.3 21.1,73.2 38.7,73.2 38.8,73.3 38.8,78.3 37.7,79.4 34.1,79.4
L2_SNS-
  Top 0.203: U9.P$1 14.7,82.9 15.9,81.7 R12.P$1
  pour Top (rank 2): 16,80 18.9,80 18.9,84.4 17.9,85.4 17.9,93.2 16.4,94.7 13.4,94.7 12.9,94.2 12.9,91.6 14.7,89.8 14.7,86.3 15.9,85.1 15.9,80.1
L2_ST  (via drill 0.35)
  Top 0.203: U13.P$4 23.26,5.1 22.4,5.1 22.07,4.77 | 22.07,4.77 20.9,3.6 R38.1 | v22.8,4 22.45,4.35 22.07,4.73 22.07,4.77 | U1.P$4 34.31,42.64 34.18,42.52 33.62,42.52 33.43,42.7 v28.62,42.7 28.6,42.7 | v32.6,15.5 22.5,25.6 v22.5,28.6
  Route3 0.203: v22.8,4 24.02,4 25.66,5.64 28.14,5.64 32.6,10.1 32.6,14.3 32.6,14.7 32.6,14.8 v32.6,15.5 | v22.8,36.7 25.62,39.52 25.62,42.98 26.02,43.38 26.58,43.38 27.27,42.7 v28.62,42.7
  Bottom 0.203: v22.5,28.6 22.88,28.98 22.88,30.58 22.8,30.67 v22.8,36.7 | v22.8,36.7 22.8,36.9 v22.8,36.7
L2_TEMP  (via drill 0.35)
  Top 0.203: T2.- 17.6,53.2 v17.7,53.2 | v17.7,53.2 17.9,53.2 v17.7,53.2 | v54.2,34.9 57.8,31.3 57.8,15.8 58.99,14.61 62.99,14.61 70.9,6.7 V9.P$1
  Bottom 0.203: v17.7,53.2 16.87,54.03 16.87,56.89 16.46,56.89 16.46,56.27 20.35,52.38 27.76,52.38 35.56,44.58 39.82,44.58 44.39,40.01 49.16,40.01 53.97,35.2 54.1,35.2 54.2,35.1 v54.2,34.9
L_OUT  (via drill 0.35)
  Top 0.203: R38.2 22.9,2.9 V34.P$1
  other vias: 15.3,32.1 15.3,31.1 16.3,32.1 16.3,31.1 17.3,32.1 17.3,31.1
  pour Top: 24.1,1.3 31.7,1.3 31.8,1.2 31.8,4.4 30.3,5.9 30.3,7.9 30.1,8.4 26.8,8.5 25.1,8.4 22.4,8.4 22.3,7.8 22.3,6.1 22.4,6 23.9,6 24.3,5.6 24.3,1.5
  pour Bottom: 31.5,1.3 23.9,1.3 23.8,1.2 23.8,4.4 25.3,5.9 25.3,7.9 12.3,36 16.7,36 32.1,7.8 32.2,7.1 32,6 31.7,6 31.3,5.6 32.9,1.2
  pour Top (rank 2): 11.4,33.9 11.3,33.8 11.3,30.9 12.3,29.9 18.5,29.9 19,30.4 19,33.4 18.5,33.9
L_REF  (via drill 0.35)
  Top 0.203: R39.1 R40.2 32.1,5.79 30.67,5.79 30.49,5.97 30.49,7.43 30.67,7.61 31.8,7.61 v32.86,8.66 | v32.86,8.66 32.9,8.7 v32.86,8.66 | v26.3,42.7 31.1,47.5 31.1,55.5 32,56.4 36.7,56.4 37.67,55.43 U2.P$5
  Route3 0.203: v24.2,29.2 26.3,31.3 v26.3,42.7
  Bottom 0.203: v32.86,8.66 32.43,9.08 32.43,14.3 32.41,14.34 33.28,15.22 33.28,15.78 32.4,16.67 32.4,18.1 29.5,21 | 29.5,21 29,21.5 | 29.5,21 24.2,26.3 v24.2,29.2 | v24.2,29.2 24.2,29.3 v24.2,29.2
LF1_REF
  Bottom 0.203: R49.2 R50.2 48.12,51.38 48.12,47.62 56.46,39.27 60.38,39.27 61.85,37.8 61.85,36.3 62.55,35.6 66.2,35.6 67.2,36.6 67.8,36.6 68.2,36.6 81.3,36.6 V41.P$1
LF1_TEMP  (via drill 0.35)
  Top 0.203: v55.9,24.4 45.2,35.1 T3.-
  Bottom 0.203: V10.P$1 75.5,7.4 69.9,7.4 62.7,14.6 57.6,14.6 57,15.2 57,23.8 56.4,24.4 v55.9,24.4
LF2_REF  (via drill 0.35)
  Top 0.203: R47.1 43.3,28.1 43.3,27.57 43.68,27.2 v45.1,27.2 49.3,23 56.1,23 56.7,22.4 56.7,14.4 57.31,13.79 62.43,13.79 66.3,9.62 66.1,2.7 67.1,1.7 72.3,1.7 73.5,2.9 V42.P$1
  Bottom 0.203: v45.1,27.2 45,27.1 43.6,27.1 43.3,27.4 R48.2
LF3_REF
  Top 0.203: 79.6,58.76 R68.2 | 79.6,58.76 79.6,60.9 R67.2 | V49.P$1 82.26,56.1 79.6,58.76
LF3_TEMP
  Top 0.203: V11.P$1 78.4,27.5 78.4,33.9 79.1,34.6 T4.-
LF4_REF
  Top 0.152: R66.2 R65.1
  Top 0.203: R65.1 60.1,25 77.3,25 87.1,15.2 V50.P$1
LF_B1
  pour Bottom: 24.1,87.4 23.2,87.4 21.3,89.3 17.9,89.3 16.9,90.3 16.9,94.4 17.3,94.8 26,94.8 27.1,93.7 27.1,87.5 27,87.4
LF_B1_BT  (via drill 0.35)
  Top 0.203: R57.2 58,45.2 | 58,45.2 52.2,39.4 U1.P$16 | 58,45.2 58,46.2 v58.2,46.4
  Bottom 0.203: U15.P$4 59.3,47.59 58.2,46.5 v58.2,46.4
LF_B1_CHG  (via drill 0.35)
  Top 0.203: U14.P$16 38.73,65.32 38.42,65.32 37.8,65.93 37.8,66.93 37.63,67.11 36.17,67.11 35.07,66 v34.9,66 | V32.P$1 29.2,69.3 v32.54,72.64 | v32.54,72.64 32.6,72.7 v32.54,72.64 | v48.7,57.8 48.7,57.5 49.5,56.7 49.5,55.4 52,52.9 v52.2,52.9 | V35.P$1 84.85,37.4 83.4,38.85 79.15,38.85 v70.5,47.5
  Route3 0.203: v32.54,72.64 37.7,72.64 38.62,71.72 41.28,71.72 41.3,71.7 41.5,71.7 46.09,67.11 | 46.09,67.11 | 46.09,67.11 46.08,64.35 46.08,64.18 46.08,64.02 46.08,60.52 48.1,58.5 v48.7,57.8 | v52.2,52.9 52.3,52.9 53.9,51.3 66.7,51.3 v70.5,47.5
  Bottom 0.203: v34.9,66 35.1,66 35.4,66.3 R44.2 35.2,67.2 31.2,67.2 V32.P$1
LF_B1_CHGN  (via drill 0.35)
  Top 0.203: U14.P$14 40.15,66.35 v39.7,66.9 40.09,67.3 40.09,69.03 40.27,69.2 42.3,69.2 46,65.5 | U1.P$20 44.53,42 44.62,41.92 45.18,41.92 45.8,42.53 45.8,47 45.68,47.12 45.68,52.08 45.3,52.47 45.3,54.8 46,55.5 46,65.5 | 46,65.5 46,65.6
  Bottom 0.203: R42.1 37.4,68.3 37.4,67.8 38.02,67.18 38.02,65.72 38.42,65.32 38.98,65.32 39.38,65.72 39.38,66.58 v39.7,66.9
LF_B1_FAULTN  (via drill 0.35)
  Top 0.203: U14.P$15 39.65,65.55 39.6,65.6 39.3,65.6 38.7,66.2 38.7,66.78 v38.7,66.87 | U1.P$19 45.65,41.35 46.4,42.1 46.4,55.33 46.41,55.33 46.41,65.77 42.18,70 v41.3,70
  Bottom 0.203: v38.7,66.87 38.7,67.5 R43.1 39.6,68.3 v41.3,70
LF_B1_OSNS  (via drill 0.35)
  Top 0.203: 30.3,86 31.3,85 31.3,81.1 32.39,80.01 37.97,80.01 39.4,78.58 39.4,73.9 v40.4,72.9 | v50.8,59.9 50.8,58 v53.9,54.9 | V46.P$1 76,47.9 70.5,53.4 70.4,53.4 v70.3,53.5
  Top 0.254: C31.1 30.4,86.1 30.3,86 R79.1
  Route3 0.203: v40.4,72.9 42.1,72.9 47.1,67.9 47.1,63.5 50.6,60 50.7,60 v50.8,59.9 | v70.3,53.5 55.2,53.5 53.9,54.8 v53.9,54.9
LF_B1_OUTEN  (via drill 0.35)
  Top 0.203: R78.1 30,79.8 31,78.8 33,78.8 33.8,79.6 37.8,79.6 38.9,78.5 v38.9,72.4 | v49.5,59.2 49.5,58.1 54.4,53.2 v54.4,52.3 | V43.P$1 84.8,41.2 80.7,41.2 71.6,50.3 70.4,50.3 v70.4,50.2
  Route3 0.203: v38.9,72.4 39.93,72.4 40.12,72.22 41.58,72.22 45.8,68.1 46.5,67.27 46.48,64.18 46.48,62.42 49.5,59.4 v49.5,59.2 | v70.4,50.2 68.3,52.3 v54.4,52.3
LF_B1_SNS
  Top 0.203: U18.P$5 60.25,51.65 60.6,51.3 62.12,51.3 62.13,51.29 64.81,51.29 78.7,37.4 V40.P$1
LF_B1_TT  (via drill 0.35)
  Top 0.203: U1.P$15 57.76,38.76 61.2,42.2 61.2,44 R56.2 65.6,45.2 v66.5,46.1
  Bottom 0.203: v66.5,46.1 66.5,47.8 64,50.3 62.4,50.3 61.8,49.7 61.8,48.63 U15.P$2
LF_B2
  pour Bottom: 76.7,85.8 89.3,85.8 89.5,85.6 89.5,81.6 89,81.1 76.1,81.1 76.1,85.2
LF_B2_BT  (via drill 0.35)
  Top 0.203: U1.P$13 41.75,37.5 43.77,37.5 43.88,37.61 53.03,37.61 58.14,32.5 R75.2 60.6,31.8 v61.1,31.8 | v61.1,31.8 | v61.1,31.8
  Bottom 0.203: v61.1,31.8 60.28,30.98 59.92,30.98 59.52,30.58 59.52,28.52 U17.P$4
LF_B2_CHG  (via drill 0.35)
  Top 0.203: R62.2 55.74,90.4 55.54,90.19 52.49,90.19 51.6,89.3 v51.64,89.3 | v67,64.4 72.2,64.4 76.5,60.1 76.5,56.45 82.4,50.55 84.25,50.55 V47.P$1
  Top 0.254: U16.P$16 58.95,87.54 56.6,89.89 R62.2
  Bottom 0.203: v51.64,89.3 51.64,79.81 51.22,79.38 51.22,76.82 51.64,76.39 51.64,67.16 54.4,64.4 v67,64.4
LF_B2_CHGN  (via drill 0.35)
  Top 0.203: U1.P$17 47.06,40.04 47.9,40.88 47.9,66 v52.44,70.54 52.7,70.8 | R60.1 61.1,90.77 62.01,91.67 62.01,92.73 60.45,94.28 56.72,94.28 56.7,94.3 54.1,94.3 v51.7,91.9
  Top 0.254: U16.P$14 59.96,87.93 61.1,89.07 R60.1
  Route3 0.203: v52.44,70.54 52.44,76.67 52.58,76.82 52.58,91.02 v51.7,91.9
LF_B2_FAULTN  (via drill 0.35)
  Top 0.203: U1.P$18 46,40.7 47.1,41.8 47.1,67.4 v50.96,71.26 51,71.3 | v51.7,90.6 55.37,90.6 55.87,91.11 58.05,91.11 58.8,90.36
  Top 0.254: U16.P$15 59.45,88.2 58.8,88.85 58.8,90.36 R61.1
  Route3 0.203: v51.7,90.6 50.96,89.86 v50.96,71.26
LF_B2_OSNS
  Top 0.203: R82.1 75.5,69.76 79.34,65.92 80.58,65.92 82.5,64 82.5,58.55 84.35,56.7 84.35,55.5 83,54.15 V99.P$1
  Top 0.254: C38.1 R82.1
LF_B2_OUTEN  (via drill 0.35)
  Top 0.203: V51.P$1 86.9,54.05 85.55,55.4 85.55,58.07 87.35,59.87 87.35,63.98 84.46,66.87 84.46,78.64 80.8,82.3 80.8,86.7 v80.9,86.8
  Bottom 0.203: R81.1 v80.9,86.8
LF_B2_SNS
  Bottom 0.203: U19.P$5 86.75,62.34 87.35,61.73 87.35,59.45 87,59.09 V44.P$1
LF_B2_TT  (via drill 0.35)
  Top 0.203: U1.P$14 54.67,38.1 59.17,33.59 61.3,33.59 R74.2 62.4,31.9 62.6,31.7 v64.5,31.7
  Bottom 0.203: U17.P$2 61.9,28.36 61.9,30.6 63,31.7 v64.5,31.7
LFB1_SNS+
  Top 0.203: U18.P$8 62.2,51.8 62.3,51.7 65.4,51.7 69.8,56.1 69.8,63 69.6,63.2 61.29,63.2 R41.P$2
  pour Top (rank 2): 56.9,61.4 66.6,61.5 66.7,72 66.4,72.3 57.8,72.3 55.5,70 55.5,63.5
LFB2_SNS+
  Bottom 0.203: U19.P$8 arc-90 84.7,69.49 84.7,72.3 arc90 84.51,72.49 R59.P$2
  pour Bottom: 77.6,65.5 83.5,65.5 83.5,72.7 82,74.2 80.7,74.2 77.7,74.2 77.2,73.7 77.2,65.7 77.4,65.5 77.5,65.5
LIFE1  (via drill 0.35)
  Bottom 0.203: R49.1 45.44,62.64 46.06,62.64
  Bottom 1.016: R54.P$2 60.21,62.3 46.4,62.3 46.06,62.64 44.9,63.8 44.9,71.6
  other vias: 44.2,64.6 45.2,64.6 45.2,63.7 45.2,62.7 44.2,63.6
  pour Bottom (rank 2): 51.6,95.2 45.2,95.4 43.3,95.5 43.3,80.9 43.4,79.5 41.3,79.5 39.3,77.5 39.3,69.7 39.4,69.6 51,69.6 51.6,70.4
  pour Top: 39.6,73.5 39.6,78.5 37.9,80.2 37.9,84.4 38.2,84.7 42.9,84.7 45,82.6 45,74.3 44.1,73.4 39.7,73.4
  pour Top (rank 3): 40.8,63.1 40.8,62.5 42,61.3 44.9,61.3 45.7,62.1 45.7,64.8 45.4,65.1 44.6,65.1 43.7,65.1 41.7,63.1
  pour Bottom: 43.2,63.9 43.2,63.3 44.7,61.8 46.3,61.8 46.6,62.1 46.6,70 46.5,70.1 43.1,70.1 43,70 43,64.1
LIFE1FUSEOUT
  pour Bottom (rank 4): 32.6,94.9 32.6,95.2 42.3,95.2 42.3,79.7 30.1,79.7 30.1,94.9
LIFE2  (via drill 1)
  Top 0.152: 43.3,18.55 42.16,17.41 LIFEPO42.PLUS
  Top 0.203: R47.2 42.6,29.2 42.2,29.2 42,29 42,28.3 42.5,27.8 42.5,27.67 42.67,27.5 42.8,27.5 45.3,25 45.3,21.2 42.16,18.06 42.16,17.41
  Route3 0.813: v57.2,41.3 55.9,40 55.9,27.5 50.8,22.4 47.9,22.4
  Bottom 0.203: U15.P$1 63.1,47.2
  Bottom 0.61: 63.1,47.2 63.3,47 63.3,43.1 62.59,42.39 R55.P$1
  Bottom 0.813: R55.P$1 60.01,41.2 57.3,41.2 v57.2,41.3
  pour Top (rank 2): 39.2,16.3 39.2,16.7 39.6,18.9 40.5,19.8 41.8,19.8 43.5,21.5 56.7,21.5 56.6,14.2 58.8,13.9 62.9,13.9 65.8,9.1 64.5,9.1 62.3,7.9 41.8,8.2 39.8,10.7
  pour Route3 (rank 2): 39.9,16.4 39.7,16.6 39.7,19 40.6,19.9 41.9,19.9 43.6,21.6 43.6,23.4 56.7,23.4 56.7,14.3 58,14.1 63.5,13.9 67.3,9 64.6,9.2 64.4,9 41.7,9 39.9,10.8
  pour Bottom (isolate 0.1, rank 2, no thermals): 39.8,16.3 39.6,16.5 39.6,18.9 40.5,19.8 41.8,19.8 43.5,21.5 56.7,21.5 56.6,14.2 57.5,13.9 62.2,13.9 66.4,9.1 64.5,9.1 64.3,8.9 41.6,8.9 39.8,10.7
LIFE3
  Top 0.203: R67.1 65.9,76.4 61.5,76.4 LIFEPO43.PLUS
  Bottom 1.016: R72.P$2 68.61,43.4 68.61,53.75 68.7,53.84 68.7,67.5 61.2,75 LIFEPO43.PLUS
  pour Bottom: 63.9,71.7 63.9,77.5 61.8,79.6 59.3,79.6 59.5,80.7 59.5,93.8 57,95 51.8,95 51.8,70.4 62.6,70.4
  pour Top: 58.8,72.9 64.3,72.9 71.7,80.3 71.7,83.9 70.8,84.8 67.9,84.8 67.3,84.2 67.3,80.2 60.6,80.2 58.2,77.8 58.2,73.5
  pour Top (rank 2): 60.7,85.1 60.8,85.2 62.5,85.2 62.9,84.8 63.8,84.8 64.1,84.5 64.1,79.6 61.8,79.2 61.8,84 60.7,84.8
LIFE3FUSEOUT
  pour Bottom (rank 5): 62,79.7 62,79.6 72.7,79.7 72.7,95.3 59.8,95.2 59.8,79.7
LIFE4
  Top 0.152: 59.8,21.4 59.9,21.5 R65.2 59.9,21.3 61.1,20.1 61.1,17.35 LIFEPO44.PLUS
  Bottom 0.508: U17.P$1 63.1,27.1
  Bottom 1.016: LIFEPO44.PLUS 62.91,18.96 R73.P$1 62.91,26.91 63.1,27.1
  pour Top: 84,9.4 83.8,17.1 74.2,22.1 57.5,22.1 57.4,14.9 57.9,14.4 62.7,14.4 68.3,8.2 82.7,8.2 83.6,9.4
  pour Route3: 83.7,9.7 83.7,17.1 73.6,27.2 58.8,27.2 57.3,25.7 57.3,14.9 62.2,14.8 68.1,8.9 82.5,8.9 83.3,9.7
  pour Bottom: 83.8,9.7 83.8,17.1 73.8,22.1 57.5,22.1 57.4,14.9 62.2,14.8 62.7,14.4 68.2,8.9 82.6,8.9 83.4,9.7
LION1  (via drill 0.35)
  Top 0.152: R33.2 37.6,9.3 LI-ION1.PLUS
  Top 0.203: v9.1,67.5 9.1,59.4 15.2,53.3 v15.2,52.7 | v23.7,42.6 29.1,37.2 v29.1,31
  Bottom 0.203: R7.2 3,75.17 7.29,70.88 8.18,70.88 8.58,70.48 8.58,69.92 9.1,69.4 v9.1,67.5 | v29.1,31 30.32,29.78 30.48,29.78 30.88,29.38 30.88,26.65 32.12,25.42 34.68,25.42 34.95,25.15 | v15.2,52.7 14.54,52.04 14.54,48.8 15.1,48.24 18.16,48.24 23.7,42.7 v23.7,42.6
  Bottom 0.254: U4.P$9 35.75,24.65 35.6,24.5 | U4.P$10 34.95,25.15 33.7,23.9 33.7,18.7 35.3,17.1 35.3,11.6 LI-ION1.PLUS
  Bottom 0.508: 35.6,24.5 35.2,24.1
  Bottom 1.016: 35.2,24.1 34.8,23.7 34.8,19.1 C11.1 36.3,11.2 LI-ION1.PLUS
  pour Bottom (rank 4): 38.6,13.2 38.6,13.5 38,14.1 34.5,14.1 33,12.6 33,10.2 34.4,8.8 36.8,8.8 37.3,8.3 37.3,6 37.5,5.8 39.9,5.8 41.4,7.3 41.4,8 39.3,10.1 39.3,12.5
LION1_OUT
  pour Bottom (rank 2): 32.2,6.8 34,6.8 34.4,6.4 34.9,3.9 36.9,3.9 36.8,8.1 36.5,8.4 32.9,8.4 32.2,7.7
LION2  (via drill 0.35)
  Top 0.152: U5.P$10 9.15,13.45 10.1,12.5 15.2,12.5 LI-ION2.PLUS
  Top 0.25: U5.P$9 8.65,12.75
  Top 0.254: v7.9,70.2 7.3,70.8 R22.2
  Bottom 0.254: LI-ION2.PLUS 1.5,26.2 1.5,30.4 1.6,30.5 1.6,60.8 4,63.2 7.4,63.2 7.9,63.7 v7.9,70.2
  pour Top: 8.1,13.6 8.1,11 10.8,11 11.8,10.2 13.5,10.2 13.6,5.6 16.6,5.6 19.7,9.5 19.7,12.2 9.9,12.2 9.2,12.8
LION2_OUT
  pour Top (rank 2): 19.9,9.7 22,9.7 22,6.6 20.9,6.6 19.6,4 16.5,4 16.5,6.3
N$1  (via drill 0.35)
  Top 0.305: U3.P$5 9.87,47.5 v8.6,47.5
  Bottom 0.305: M1.P$4 11.64,45.06 11.3,45.06 8.86,47.5 v8.6,47.5
N$2
  Top 0.305: C24.1 D3.A
  pour Top: 10.7,37.9 9.5,37.9 9.2,37.6 9.2,31.8 9.7,31.3 10.8,31.3 11,31.5 11,37.6
N$3
  Bottom 0.305: U10.P$2 11.45,35.25 C19.1 12.1,35.6 | C23.1 14.5,39.2 D2.A
  pour Bottom (rank 4): 15.2,40.2 13.4,40.2 11.2,38 11.2,34.5 11.5,34.2 12.5,34.2 12.8,34.5 12.8,35.9 13.4,36.5 15.1,36.5 15.5,36.9 15.5,39.9
N$4
  Top 0.203: C20.2 11.5,35.8 U11.P$3
N$5
  Bottom 0.203: C19.2 10.8,36.1 U10.P$3
N$6
  Top 0.25: U5.P$4 8.65,17.05 8.5,17.2 8.01,17.2 | 8.01,17.2 5.6,17.2 L2.P$1 | C10.2 7.9,17.31 8.01,17.2
  pour Top: 8.2,17 7.6,17 6.8,16 4,16 4,19.3 8.2,19.3
N$7
  Top 0.203: U14.P$13 40.65,68.15 R51.1
N$8
  Bottom 0.254: U4.P$4 39.85,24.65 40.1,24.4
  Bottom 0.508: 40.1,24.4 C9.2 41.2,23.6 40.5,22.9 L1.P$1
N$9
  Bottom 0.203: U4.P$2 38.97,25.72 39.38,25.72 39.56,25.9 40.1,25.9 40.4,26.2 C9.1
N$10  (via drill 0.35)
  Top 0.203: v85.88,71.68 85.9,71.7 86.4,71.2 R30.1 R29.2
  Bottom 0.203: U19.P$7 85.4,69.44 85.4,71.2 v85.88,71.68 86.1,71.9 U19.P$3
N$11
  Top 0.203: U18.P$7 61.52,52.52 61.52,52.96 60.9,53.58 60.9,53.71 60.9,54.53 | 60.9,54.53 U18.P$3 | R26.1 62.4,49.7 R24.2 58.6,51.2 58.6,53.8 59.2,54.4 60.77,54.4 60.9,54.53
N$12
  Bottom 0.203: 81.3,75.7 81.3,75.8 82,75.8 83.2,75.8 84.86,74.41 84.86,73.11 84.72,73.1 84.72,74.4 83.2,75.7 82,75.7 81.3,75.7 | 81.3,75.7 81.3,75.6 81.3,75.7
N$13
  Bottom 0.203: U4.P$1 40.95,28.2 C7.1
N$14
  Top 0.203: U5.P$2 9.65,18.35 C10.1
N$15
  Top 0.203: U1.P$7 37.5,40.7 39.1,39.1 R32.2
N$16
  pour Bottom (rank 4): 8.6,84.2 8,84.8 6.4,84.8 5.3,83.7 5.3,81.8 5.7,81.4 7.5,81.4 8.9,80 8.9,79.3 9,79.2 10,79.2 10,82.8
N$17
  Top 0.203: U5.P$1 10.15,17.15 C8.1
N$18
  Bottom 0.254: 36.85,23.32 U4.P$8
  Bottom 0.508: L1.P$2 36.5,22.46 36.85,22.81 36.85,23.32
N$19
  Top 0.203: 7.1,0 7.1,8.5 0,8.5 0,86.9 0,87 7.1,87 7.1,96 83.6,96 83.6,87 90.6,87 90.6,8.5 83.6,8.5 83.6,0 7.1,0
N$22  (via drill 0.35)
  Top 0.254: 38.5,21.96 v38.5,20.3 | 38.5,21.96 R27.1 | R28.2 38.54,22 38.5,21.96
  Bottom 0.254: U4.P$6 37.85,23.8 37.84,23.79 37.84,21.06 38.5,20.4 v38.5,20.3
N$24
  Bottom 0.406: U15.P$8 62.5,54.4 U15.P$7
  Bottom 1.016: R54.P$1 62.11,56.98 62.11,56.25 62.5,55.86 62.5,54.4
N$25
  Bottom 0.203: 59.99,54.4 U15.P$6 | 59.99,54.4 59.9,54.4 | U15.P$5 59.99,54.4
  Bottom 1.016: 59.9,54.4 59.9,51.31 57.11,48.52 57.11,45.95 57.75,45.31 58.65,45.31 59.15,45.81 R55.P$2
N$26
  Top 0.203: R52.1 42.5,65.7 42.5,64.6 41.77,63.87 41.22,63.87 U14.P$11
N$27  (via drill 0.35)
  Top 0.203: U14.P$6 39.65,61.32 39.68,61.28 39.68,59.38 v39.1,58.8
  Bottom 0.203: R45.1 R46.2 35.1,58.9 39.1,58.9 v39.1,58.8
N$28  (via drill 0.35)
  Top 0.203: U14.P$10 42.05,63.35 43.4,64.7 R52.2 43.4,66.8 v42,68.2
  Bottom 0.203: v42,68.2 41.6,67.8 R53.1
N$29
  Top 0.203: U14.P$1 38.1,64.35 38.1,64.63 36.9,65.43 C26.2
N$30
  pour Top (rank 5): 38.9,63 36.8,63 36.3,62.5 36,62.2 36,57.8 36.5,57.3 38.3,57.3 38.3,61.6 38.9,62.2
N$31
  Top 0.203: U14.P$2 38.58,63.83 37.71,63.83 37.44,64.1 C27.2
N$32
  pour Top: 40.5,62.7 40.3,62.5 40.3,62 39.7,61.4 39.7,57.8 40.2,57.3 42.3,57.3 42.9,57.9 42.9,59.4 41.4,60.9 41.4,62.4 41.1,62.7
N$33
  Top 0.203: R63.1 52,82.4 52.4,82 R64.2 53.3,80.3 54.73,80.3 58.1,80.3 59.37,81.57 59.37,82.6 59.45,82.68 U16.P$6
N$34  (via drill 0.35)
  Top 0.203: R4.2 R6.1 13.79,89 v14.2,88.59
  Bottom 0.203: U8.P$7 13.7,85.64 13.7,86.4 13.89,86.59 13.89,86.67 14.2,86.97 v14.2,88.59 14.2,89.1 14.3,89.2 U8.P$3
N$35
  Top 0.254: U16.P$13 60.46,87.72 61.24,88.5 R69.1
N$36
  Top 0.203: U16.P$11 62.42,85.84 62.58,86 R70.1
N$37
  Top 0.203: U16.P$10 62.63,85.34 62.81,85.16 | 62.87,85.09 63.93,85.09 64.83,86 R70.2 | 62.81,85.16 62.87,85.09 | R71.1 63.91,85.09 62.87,85.09 | 62.87,85.09 62.81,85.16
N$38
  Top 0.254: U16.P$1 57.96,86.34 57.6,86.7 57.6,87.6 56.8,88.4 C33.2
N$39
  Top 0.203: 57.7,84.2 57.7,84.85 57.14,84.85 U16.P$4
  pour Top (rank 4): 59.1,84.5 59,84.4 58.1,84.3 57.5,84 57.5,80.7 55.3,80.7 55.3,83 55.6,83.3 55.6,85.2 55.7,85.3 57.4,85.3 57.6,85.1 58.9,85.3
N$40
  Top 0.203: U16.P$2 57.83,85.86 57.29,86.4 C34.2
N$41
  Top 0.203: U16.P$8
  pour Top (rank 3): 59.5,80.4 61.4,80.4 61.4,84.4 60.7,84.8 60.2,84.8 59.5,84.1
N$42
  Bottom 0.254: U17.P$7 62.4,34.1 U17.P$8
  Bottom 0.813: R72.P$1 61.14,36.05 61.14,36.01 62.4,34.75 62.4,34.1
N$43
  Bottom 0.203: 59.8,34.1 U17.P$5
  Bottom 0.813: R73.P$2 59.39,24.4 58.2,24.4 57.7,24.9 57.7,32.7 59.1,34.1 U17.P$5 | U17.P$6 59.8,34.1
N$44
  Bottom 0.203: U6.P$5 8.61,79.99 7.88,80.72 7.88,80.98 7.48,81.38 5.92,81.38 5.52,80.98 5.52,79.62 5.4,79.5 4.77,79.5 | 4.77,79.5 C13.2 | R7.1 4.8,79.47 4.77,79.5
N$45
  Bottom 0.254: U6.P$2 8.61,74.21 R8.2
N$48
  Top 0.203: U5.P$6 2.55,15.55 R10.1 R11.2
N$49
  Top 0.25: U5.P$8 6.95,14.55 L2.P$2
  pour Top: 7.7,14.7 5.4,14.7 4.1,13.6 4.1,11.9 7.7,11.9
N$51
  Top 0.203: 11.04,80.14 13.32,82.42 | 11.04,80.14 R21.1 | 13.32,82.42 13.4,82.5 U9.P$3 | U9.P$7 14,80.14 14,81 13.32,81.68 13.32,82.42 | R20.2 11.04,77.64 11.04,80.14
N$52
  pour Top: 2.1,84.8 4.8,84.8 5,84.6 5,81.9 5,80.6 3.4,79 3.4,77.7 2.6,77.7 2.4,77.9 2.4,80.3 1.7,81 1.7,84.8
N$53
  Top 0.203: U7.P$2 3.7,73.9 5.9,71.7 R23.2
N$54
  Top 0.203: U7.P$5 3.69,78.59 4.3,79.2 5.6,79.2 C14.2
  Top 0.254: C14.2 R22.1
N$68  (via drill 0.35)
  Top 0.203: v27.5,84.8 27.5,84.5 27.5,84.1 R77.2 | R77.2 C29.2 | R77.2 R78.2
  Bottom 0.203: SW1.P$2 27.77,84.77 27.8,84.8 v27.5,84.8
N$451  (via drill 0.35)
  Top 0.254: R82.2 v75.5,88.1 75,88.6 R76.2
  Bottom 0.254: SW2.P$3 76.24,87.26 75.5,88 v75.5,88.1
N$686  (via drill 0.35)
  Top 0.203: 25.5,87.2 R58.2 | 25.5,87.2 v28.1,87.2 | R79.2 24.4,86 25.5,87.2
  Bottom 0.203: SW1.P$3 24.74,86 26.6,86 27.8,87.2 v28.1,87.2
N$1356
  Bottom 0.254: C36.2 80.8,92.4 R80.2 80.9,92.1 R81.2 79.6,88.8 79.6,88.6 79.53,88.53 SW2.P$2
PANELREF  (via drill 0.35)
  Top 0.203: 35.55,53.88 35.23,54.09 34.07,54.09 33.87,53.9 v31.9,53.9 | 35.55,53.88 35.7,53.88 | 35.7,53.88 U2.P$6 | v13.3,57.5 14.74,57.5 15.1,57.86 15.9,57.86 v19.85,53.91 | 35.7,53.88 35.55,53.88
  Bottom 0.152: R14.2 R13.1
  Bottom 0.203: R13.1 13.3,56.5 v13.3,57.5 | v19.85,53.91 v19.86,53.9 v31.9,53.9
SCL
  Top 0.203: U2.P$1 40.72,52.58 40.9,52.4 40.9,52.38 | 40.9,52.38 40.9,50.5 V5.P$1 41.4,49.4 44.2,49.4 44.9,48.7 44.9,44.7 43.5,43.3 U1.P$22 | R85.1 42.12,53.6 40.9,52.38
SDA
  Top 0.203: R86.1 35.9,49.4 V6.P$1 | V6.P$1 | U2.P$2 39.63,53.23 39.2,52.8 39.2,51.9 37.8,50.5 V6.P$1 | 37.7,47.6 V6.P$1 | V6.P$1 | V6.P$1 38.6,48.3 41.29,48.3 41.8,48.81 44.05,48.81 44.41,48.45 44.41,45.35 44.4,45.34 44.4,45.2 43.15,43.95 U1.P$23
SP_C
  pour Bottom: 1.4,34.2 1.4,55.8 4.2,55.8 4.7,55.8 7.1,53.4 7.1,44 6.9,43.8 5.7,43.8 5,43.1 5,34.2
  pour Top (rank 3): 1.4,55.5 1.4,34.1 5.7,34.1 5.7,48.2 8.2,48.2 8.2,51.4 7.3,52.3 5.7,52.3 5.3,52.7 5.3,54.7 4.5,55.5
SP_OUT  (via drill 0.35, 0.8)
  Top 0.203: U5.P$3 9.15,17.35 8.8,17.7 | R10.2 2.4,18.4 3.8,19.8 8.6,19.8 8.8,19.6
  Top 0.254: U14.P$3 37.96,63.35
  Top 0.406: 8.8,19.6 8.8,17.7
  Top 1.016: C5.1 40.9,26 | 43.4,25.4 v43.5,25.4 | v43.5,25.4 43.6,25.4 v43.5,25.4
  Bottom 0.254: U10.P$8 12.1,43 12.8,43 v13.9,44.1 | U4.P$3 39.44,25.14 39.6,25.3 39.9,25.3 | R45.2 v34.9,64.5
  Bottom 0.508: v43.5,25.4 43.4,25.3 39.9,25.3
  other vias: 9.1,29.8 7.7,29.8 7.7,28.4 7.7,27 13.9,45.5 13.9,46.9
  pour Top: 7.3,19.7 7,20 7,29.9 7.5,30.4 10.6,30.4 11.2,29.8 11.2,28.7 11.8,28.1 11.9,21.2 11.7,20.1 10.8,19.7
  pour Bottom: 7,26.3 8.7,26.3 10.7,28.3 10.7,32.3 9,34 9,39 10.4,40.4 10.4,42.3 10.8,42.7 14.3,42.7 15.9,44.3 15.9,46.1 14.3,47.7 14.3,53.4 13.4,54.3 10.9,54.3 10.6,54 10.6,52.1 11.4,51.3 11.4,49.5 11,49.1 11,46.3 6.8,42.1 6.8,26.5
  pour Top: 7.8,56.4 11.8,56.4 13.3,54.9 13.4,48.4 14.7,47.1 14.6,40.9 14.3,40.6 9.7,40.6 9.3,41 9.3,42.1 11.1,43.9 11.1,47.8 10.7,48.2 8.8,48.2 8.6,48.4 8.6,52.1 7.7,53 7.7,56.3
  pour Top (rank 3): 14.3,43.1 17.5,43.1 26.3,34.8 26.3,24.9 29.1,22.5 39.8,22.5 40.2,23.9 40.3,24.6 44.6,24.6 44.6,25.8 41.9,28.5 40.3,28.5 38.5,26.7 38.5,24.7 38.3,24.5 34.3,24.5 33.2,25.6 28.9,25.6 28.9,36 19.9,44.9 20.5,45.6 32.1,57.2 32.1,60.4 33.3,61.7 35.8,61.7 36.8,62.7 38,63.3 39.1,63.3 39.1,63.9 35.7,63.9 35.6,64 35.6,68.7 36.7,69.8 47,69.8 50,73.3 50.1,83.4 50.8,84.8 55.2,84.7 56.2,84.9 59.1,84.9 59.2,85 59.2,85.6 59.1,85.7 57.8,85.7 57.3,86.2 55.8,86.2 55,87 49.8,87 46.4,83.6 46.4,74.7 44.5,72.8 33.5,72.8 30.6,70.1 30.6,63.6 17.3,49.5 17.3,47.1 14.5,47.1 14.3,46.9
SPF_ST  (via drill 0.35)
  Top 0.203: 9.42,42.62 9.5,42.7 | 9.42,42.62 9.1,42.3 9.1,39.83 10.32,38.62 12.08,38.62 12.1,38.6 13.5,38.6 15.4,40.5 v19.23,40.5 19.3,40.43 | R83.1 17.9,37.5 19.3,38.9 19.3,40.43 | 19.3,40.43 19.37,40.5 | v29.9,41.3 36.05,41.3 U1.P$6 | U3.P$4 9.92,43.12 9.42,42.62
  Bottom 0.203: v19.23,40.5 19.2,40.5 20,41.3 v29.9,41.3
UMB_CHG
  pour Top (rank 2): 7.5,54.2 7.5,56.7 5,59.2 2.1,59.2 1.4,58.5 1.4,56.4 1.8,56 4.6,56 5.6,55 5.6,53.1 6.2,52.5 7.4,52.5 7.5,52.5

## Text on the board
tNames: BSE: EquiSat / Battery Board V2 / September 2017
bNames: BSE: EquiSat / Battery Board V2 / September 2017
bValues: X_N | Z_P | Z_N | Y_N | X_P
tDocu: +Z | +X
bDocu: +Z | +X